# EAGLE design inktime (EAGLE 9.7.0)

## Sheet 1 of 2
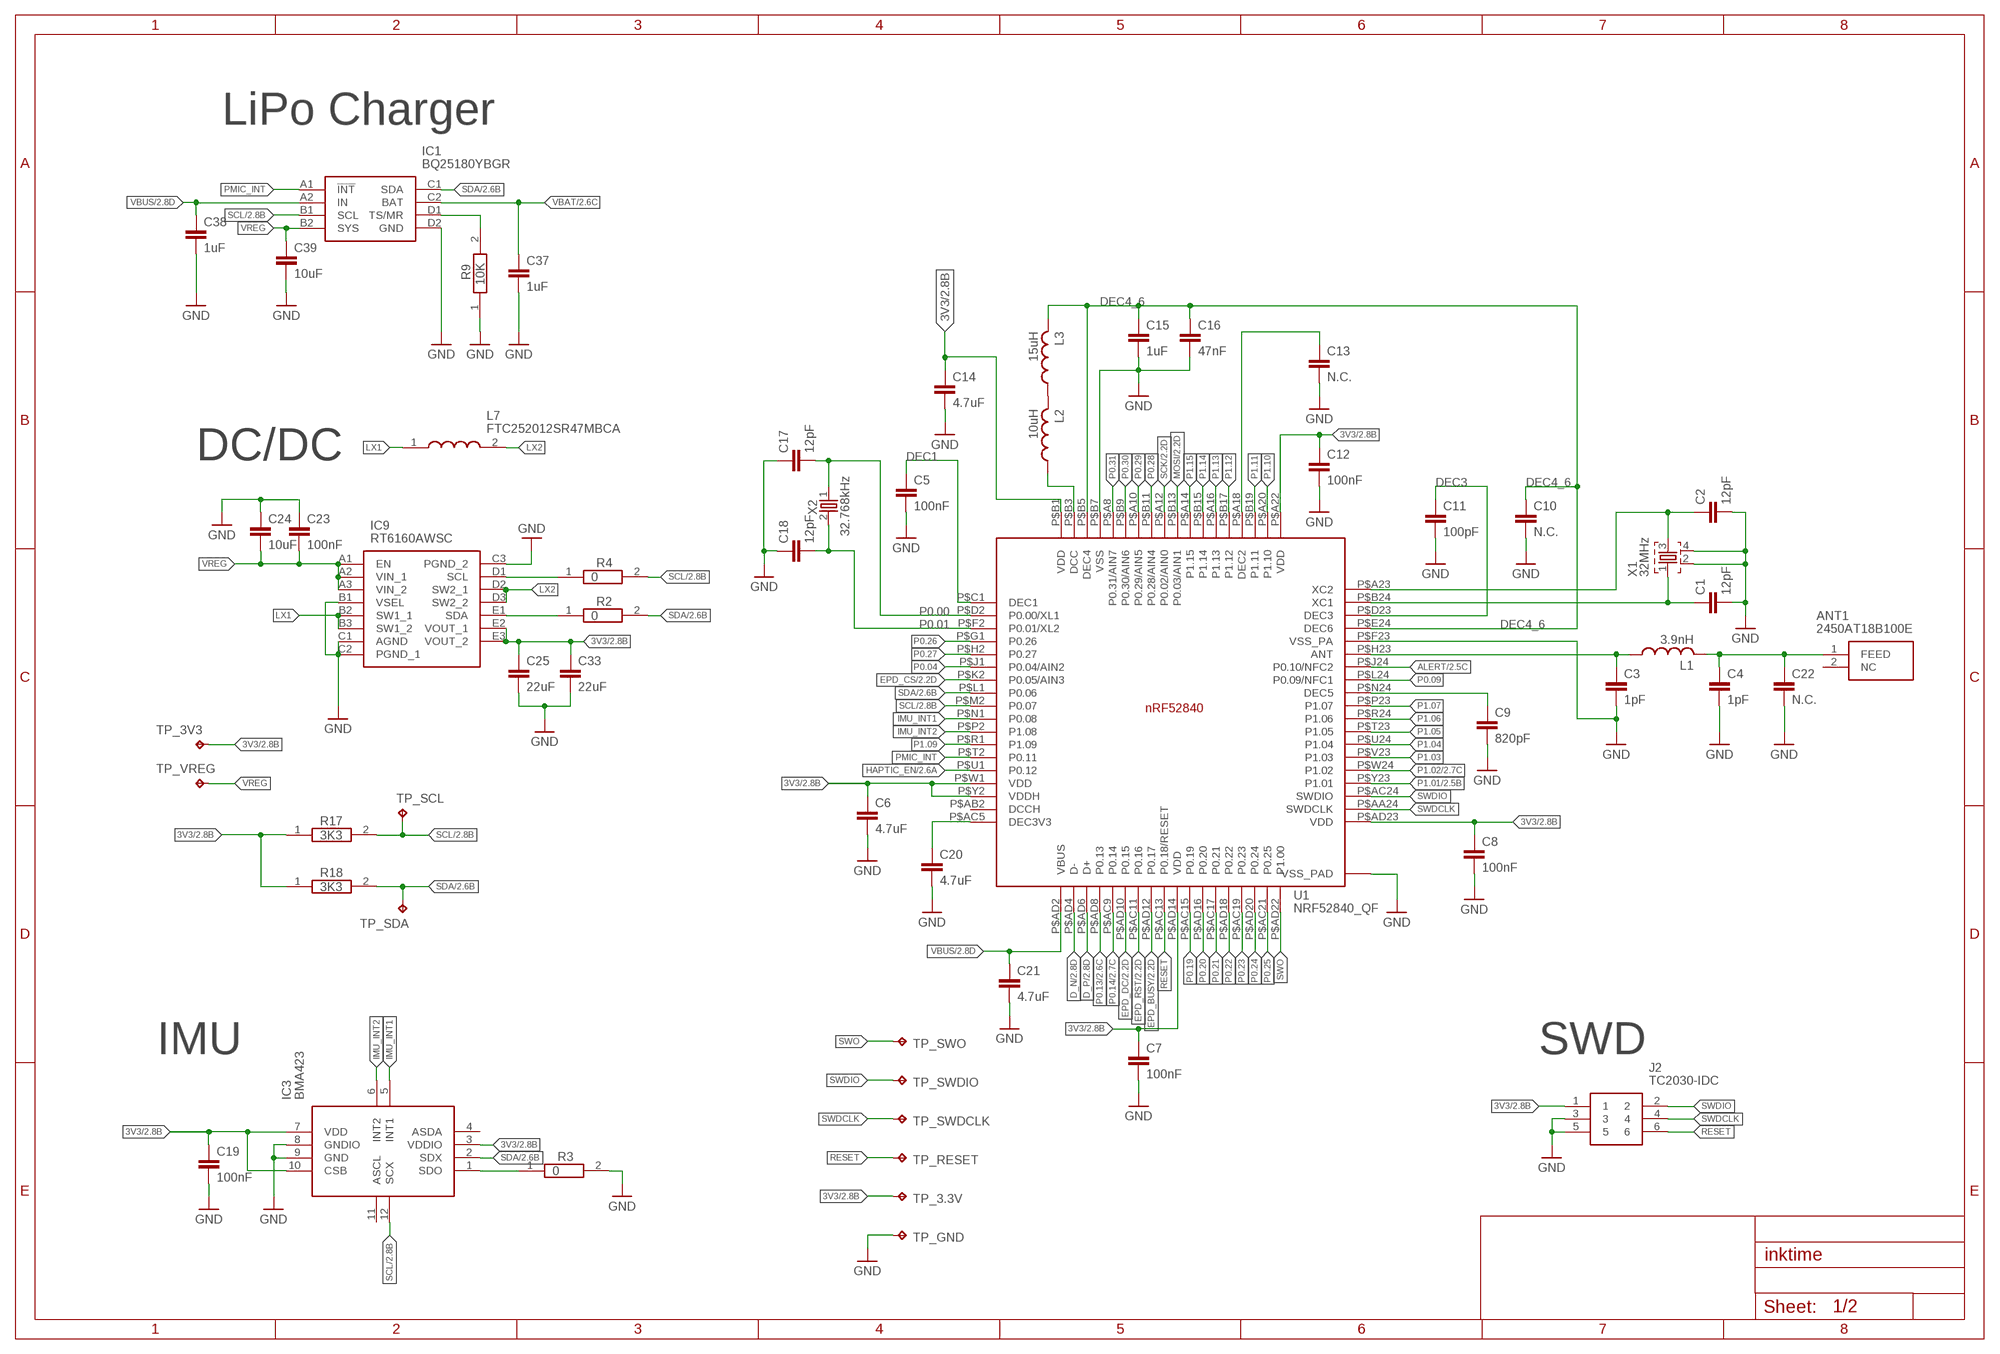
[diagram p0: schematic, sheet 1]

### Parts
ANT1  2450AT18B100E  2450AT18B100E_2450AT18B100E  [2450AT18B100E_ANTC3216X140N]
C1  12pF  NORDIC_NRF_3_CAPACITOR_0201_L  [NORDIC_NRF_3_RESC0201_L]
C2  12pF  NORDIC_NRF_3_CAPACITOR_0201_L  [NORDIC_NRF_3_RESC0201_L]
C3  1pF  NORDIC_NRF_3_CAPACITOR_0201_L  [NORDIC_NRF_3_RESC0201_L]
C4  1pF  NORDIC_NRF_3_CAPACITOR_0201_L  [NORDIC_NRF_3_RESC0201_L]
C5  100nF  NORDIC_NRF_3_CAPACITOR_0201_L  [NORDIC_NRF_3_RESC0201_L]
C6  4.7uF  NORDIC_NRF_3_CAPACITOR_0402_L  [NORDIC_NRF_3_RESC0402_L]
C7  100nF  NORDIC_NRF_3_CAPACITOR_0201_L  [NORDIC_NRF_3_RESC0201_L]
C8  100nF  NORDIC_NRF_3_CAPACITOR_0201_L  [NORDIC_NRF_3_RESC0201_L]
C9  820pF  NORDIC_NRF_3_CAPACITOR_0201_L  [NORDIC_NRF_3_RESC0201_L]
C10  N.C.  NORDIC_NRF_3_CAPACITOR_0201_L  [NORDIC_NRF_3_RESC0201_L]
C11  100pF  NORDIC_NRF_3_CAPACITOR_0201_L  [NORDIC_NRF_3_RESC0201_L]
C12  100nF  NORDIC_NRF_3_CAPACITOR_0201_L  [NORDIC_NRF_3_RESC0201_L]
C13  N.C.  NORDIC_NRF_3_CAPACITOR_0201_L  [NORDIC_NRF_3_RESC0201_L]
C14  4.7uF  NORDIC_NRF_3_CAPACITOR_0402_L  [NORDIC_NRF_3_RESC0402_L]
C15  1uF  NORDIC_NRF_3_CAPACITOR_0402_L  [NORDIC_NRF_3_RESC0402_L]
C16  47nF  NORDIC_NRF_3_CAPACITOR_0201_L  [NORDIC_NRF_3_RESC0201_L]
C17  12pF  NORDIC_NRF_3_CAPACITOR_0201_L  [NORDIC_NRF_3_RESC0201_L]
C18  12pF  NORDIC_NRF_3_CAPACITOR_0201_L  [NORDIC_NRF_3_RESC0201_L]
C19  100nF  NORDIC_NRF_3_CAPACITOR_0201_L  [NORDIC_NRF_3_RESC0201_L]
C20  4.7uF  NORDIC_NRF_3_CAPACITOR_0402_L  [NORDIC_NRF_3_RESC0402_L]
C21  4.7uF  NORDIC_NRF_3_CAPACITOR_0402_L  [NORDIC_NRF_3_RESC0402_L]
C22  N.C.  NORDIC_NRF_3_CAPACITOR_0201_L  [NORDIC_NRF_3_RESC0201_L]
C23  100nF  NORDIC_NRF_3_CAPACITOR_0201_L  [NORDIC_NRF_3_RESC0201_L]
C24  10uF  NORDIC_NRF_3_CAPACITOR_0402_L  [NORDIC_NRF_3_RESC0402_L]
C25  22uF  NORDIC_NRF_3_CAPACITOR_0402_L  [NORDIC_NRF_3_RESC0402_L]
C33  22uF  NORDIC_NRF_3_CAPACITOR_0402_L  [NORDIC_NRF_3_RESC0402_L]
C37  1uF  NORDIC_NRF_3_CAPACITOR_0402_L  [NORDIC_NRF_3_RESC0402_L]
C38  1uF  NORDIC_NRF_3_CAPACITOR_0402_L  [NORDIC_NRF_3_RESC0402_L]
C39  10uF  NORDIC_NRF_3_CAPACITOR_0402_L  [NORDIC_NRF_3_RESC0402_L]
IC1  BQ25180YBGR  BQ25180YBGR_BQ25180YBGR  [BQ25180YBGR_BGA8C40P2X4_100X155X50]
IC3  BMA423  BMA423_BMA423  [BMA423_BMA423]
IC9  RT6160AWSC  RT6160AWSC_RT6160AWSC  [RT6160AWSC_BGA15C40P3X5_140X230X60]
J2  TC2030-IDC  TC2030-IDC_TC2030-IDC  [TC2030-IDC_TC2030IDC]
L1  3.9nH  NORDIC_NRF_2_INDUCTOR_0402_L  [NORDIC_NRF_2_RESC0402_L]
L2  10uH  NORDIC_NRF_2_INDUCTOR_0402_L  [NORDIC_NRF_2_RESC0402_L]
L3  15uH  NORDIC_NRF_2_INDUCTOR_0402_L  [NORDIC_NRF_2_RESC0402_L]
L7  FTC252012SR47MBCA  MLP2016SR47MT0S1_FTC252012SR47MBCA  [MLP2016SR47MT0S1_INDC2016X100N]
R2  0  CPF0201D7K68C1_CPF0201D7K68C1  [CPF0201D7K68C1_0201]
R3  0  CPF0201D7K68C1_CPF0201D7K68C1  [CPF0201D7K68C1_0201]
R4  0  CPF0201D7K68C1_CPF0201D7K68C1  [CPF0201D7K68C1_0201]
R9  10K  CPF0201D7K68C1_CPF0201D7K68C1  [CPF0201D7K68C1_0201]
R17  3K3  CPF0201D7K68C1_CPF0201D7K68C1  [CPF0201D7K68C1_0201]
R18  3K3  CPF0201D7K68C1_CPF0201D7K68C1  [CPF0201D7K68C1_0201]
TP_3.3V  HECTOR_WATCH_1_TPTP20R  [HECTOR_WATCH_1_TP20R]
TP_3V3  HECTOR_WATCH_1_TPTP20R  [HECTOR_WATCH_1_TP20R]
TP_GND  HECTOR_WATCH_1_TPTP20R  [HECTOR_WATCH_1_TP20R]
TP_RESET  HECTOR_WATCH_1_TPTP20R  [HECTOR_WATCH_1_TP20R]
TP_SCL  HECTOR_WATCH_1_TPTP20R  [HECTOR_WATCH_1_TP20R]
TP_SDA  HECTOR_WATCH_1_TPTP20R  [HECTOR_WATCH_1_TP20R]
TP_SWDCLK  HECTOR_WATCH_1_TPTP20R  [HECTOR_WATCH_1_TP20R]
TP_SWDIO  HECTOR_WATCH_1_TPTP20R  [HECTOR_WATCH_1_TP20R]
TP_SWO  HECTOR_WATCH_1_TPTP20R  [HECTOR_WATCH_1_TP20R]
TP_VREG  HECTOR_WATCH_1_TPTP20R  [HECTOR_WATCH_1_TP20R]
U1  NRF52840_QF  NORDIC_NRF_4_NRF52840_QF  [NORDIC_NRF_4_AQFN50P700X700X85_HS-74N]
X1  32MHz  NORDIC_NRF_XTAL_32MHZ  [NORDIC_NRF_BT-XTAL_2016_N]
X2  32.768kHz  NORDIC_NRF_1_XTAL_32KHZ  [NORDIC_NRF_1_XTAL_3215_N]

### Nets
3V3: C6.1 C7.1 C8.1 C12.1 C14.1 C19.1 C25.1 C33.1 IC3.3(VDDIO) IC3.7(VDD) IC3.10(CSB) IC9.E2(VOUT_1) IC9.E3(VOUT_2) J2.1 R17.1 R18.1 TP_3.3V.TP TP_3V3.TP U1.P$A22(VDD) U1.P$AD14(VDD) U1.P$AD23(VDD) U1.P$B1(VDD) U1.P$W1(VDD) U1.P$Y2(VDDH) ; also sheet 2
ALERT: U1.P$J24(P0.10/NFC2) ; also sheet 2
D_N: U1.P$AD4(D-) ; also sheet 2
D_P: U1.P$AD6(D+) ; also sheet 2
DEC1: C5.1 U1.P$C1(DEC1)
DEC3: C11.1 U1.P$D23(DEC3)
DEC4_6: C10.1 C15.1 C16.1 L3.2 U1.P$B5(DEC4) U1.P$E24(DEC6)
EPD_BUSY: U1.P$AD12(P0.17) ; also sheet 2
EPD_CS: U1.P$K2(P0.05/AIN3) ; also sheet 2
EPD_DC: U1.P$AD10(P0.15) ; also sheet 2
EPD_RST: U1.P$AC11(P0.16) ; also sheet 2
GND: C1.2 C2.2 C3.2 C4.2 C5.2 C6.2 C7.2 C8.2 C9.2 C10.2 C11.2 C12.2 C13.2 C14.2 C15.2 C16.2 C17.1 C18.1 C19.2 C20.2 C21.2 C22.2 C23.1 C24.1 C25.2 C33.2 C37.2 C38.2 C39.2 IC1.D2(GND) IC3.8(GNDIO) IC3.9(GND) IC9.B1(VSEL) IC9.C1(AGND) IC9.C2(PGND_1) IC9.C3(PGND_2) J2.3 J2.5 R3.2 R9.1 TP_GND.TP U1.P$74(VSS_PAD) U1.P$75(VSS_PAD) U1.P$76(VSS_PAD) U1.P$77(VSS_PAD) U1.P$78(VSS_PAD) U1.P$79(VSS_PAD) U1.P$80(VSS_PAD) U1.P$81(VSS_PAD) U1.P$82(VSS_PAD) U1.P$83(VSS_PAD) U1.P$84(VSS_PAD) U1.P$85(VSS_PAD) U1.P$86(VSS_PAD) U1.P$87(VSS_PAD) U1.P$88(VSS_PAD) U1.P$89(VSS_PAD) U1.P$90(VSS_PAD) U1.P$B7(VSS) U1.P$F23(VSS_PA) X1.2 X1.4 ; also sheet 2
HAPTIC_EN: U1.P$U1(P0.12) ; also sheet 2
IMU_INT1: IC3.5(INT1) U1.P$N1(P0.08)
IMU_INT2: IC3.6(INT2) U1.P$P2(P1.08)
LX1: IC9.B2(SW1_1) IC9.B3(SW1_2) L7.1
LX2: IC9.D2(SW2_1) IC9.D3(SW2_2) L7.2
MOSI: U1.P$B13(P0.03/AIN1) ; also sheet 2
N$3: IC1.D1(TS/MR) R9.2
N$4: ANT1.1(FEED) C4.1 C22.1 L1.2
N$5: C2.1 U1.P$A23(XC2) X1.3
N$6: C1.1 U1.P$B24(XC1) X1.1
N$8: IC9.E1(SDA) R2.1
N$10: IC9.D1(SCL) R4.1
N$12: C13.1 U1.P$A18(DEC2)
N$14: IC3.1(SDO) R3.1
N$15: C20.1 U1.P$AC5(DEC3V3)
N$19: L2.1 U1.P$B3(DCC)
N$20: L2.2 L3.1
N$22: C9.1 U1.P$N24(DEC5)
N$25: C3.1 L1.1 U1.P$H23(ANT)
P0.00: C17.2 U1.P$D2(P0.00/XL1) X2.1
P0.01: C18.2 U1.P$F2(P0.01/XL2) X2.2
P0.04: U1.P$J1(P0.04/AIN2)
P0.09: U1.P$L24(P0.09/NFC1)
P0.13: U1.P$AD8(P0.13) ; also sheet 2
P0.14: U1.P$AC9(P0.14) ; also sheet 2
P0.19: U1.P$AC15(P0.19)
P0.20: U1.P$AD16(P0.20)
P0.21: U1.P$AC17(P0.21)
P0.22: U1.P$AD18(P0.22)
P0.23: U1.P$AC19(P0.23)
P0.24: U1.P$AD20(P0.24)
P0.25: U1.P$AC21(P0.25)
P0.26: U1.P$G1(P0.26)
P0.27: U1.P$H2(P0.27)
P0.28: U1.P$B11(P0.28/AIN4)
P0.29: U1.P$A10(P0.29/AIN5)
P0.30: U1.P$B9(P0.30/AIN6)
P0.31: U1.P$A8(P0.31/AIN7)
P1.01: U1.P$Y23(P1.01) ; also sheet 2
P1.02: U1.P$W24(P1.02) ; also sheet 2
P1.03: U1.P$V23(P1.03)
P1.04: U1.P$U24(P1.04)
P1.05: U1.P$T23(P1.05)
P1.06: U1.P$R24(P1.06)
P1.07: U1.P$P23(P1.07)
P1.09: U1.P$R1(P1.09)
P1.10: U1.P$A20(P1.10)
P1.11: U1.P$B19(P1.11)
P1.12: U1.P$B17(P1.12)
P1.13: U1.P$A16(P1.13)
P1.14: U1.P$B15(P1.14)
P1.15: U1.P$A14(P1.15)
PMIC_INT: IC1.A1(!INT) U1.P$T2(P0.11)
RESET: J2.6 TP_RESET.TP U1.P$AC13(P0.18/RESET)
SCK: U1.P$A12(P0.02/AIN0) ; also sheet 2
SCL: IC1.B1(SCL) IC3.12(SCX) R4.2 R17.2 TP_SCL.TP U1.P$M2(P0.07) ; also sheet 2
SDA: IC1.C1(SDA) IC3.2(SDX) R2.2 R18.2 TP_SDA.TP U1.P$L1(P0.06) ; also sheet 2
SWDCLK: J2.4 TP_SWDCLK.TP U1.P$AA24(SWDCLK)
SWDIO: J2.2 TP_SWDIO.TP U1.P$AC24(SWDIO)
SWO: TP_SWO.TP U1.P$AD22(P1.00)
VBAT: C37.1 IC1.C2(BAT) ; also sheet 2
VBUS: C21.1 C38.1 IC1.A2(IN) U1.P$AD2(VBUS) ; also sheet 2
VREG: C23.2 C24.2 C39.1 IC1.B2(SYS) IC9.A1(EN) IC9.A2(VIN_1) IC9.A3(VIN_2) TP_VREG.TP
Unconnected: ANT1.2(NC) IC3.4(ASDA) IC3.11(ASCL) U1.P$AB2(DCCH)

### Notes on the sheet
- LiPo Charger
- DC/DC
- IMU | SWD

## Sheet 2 of 2
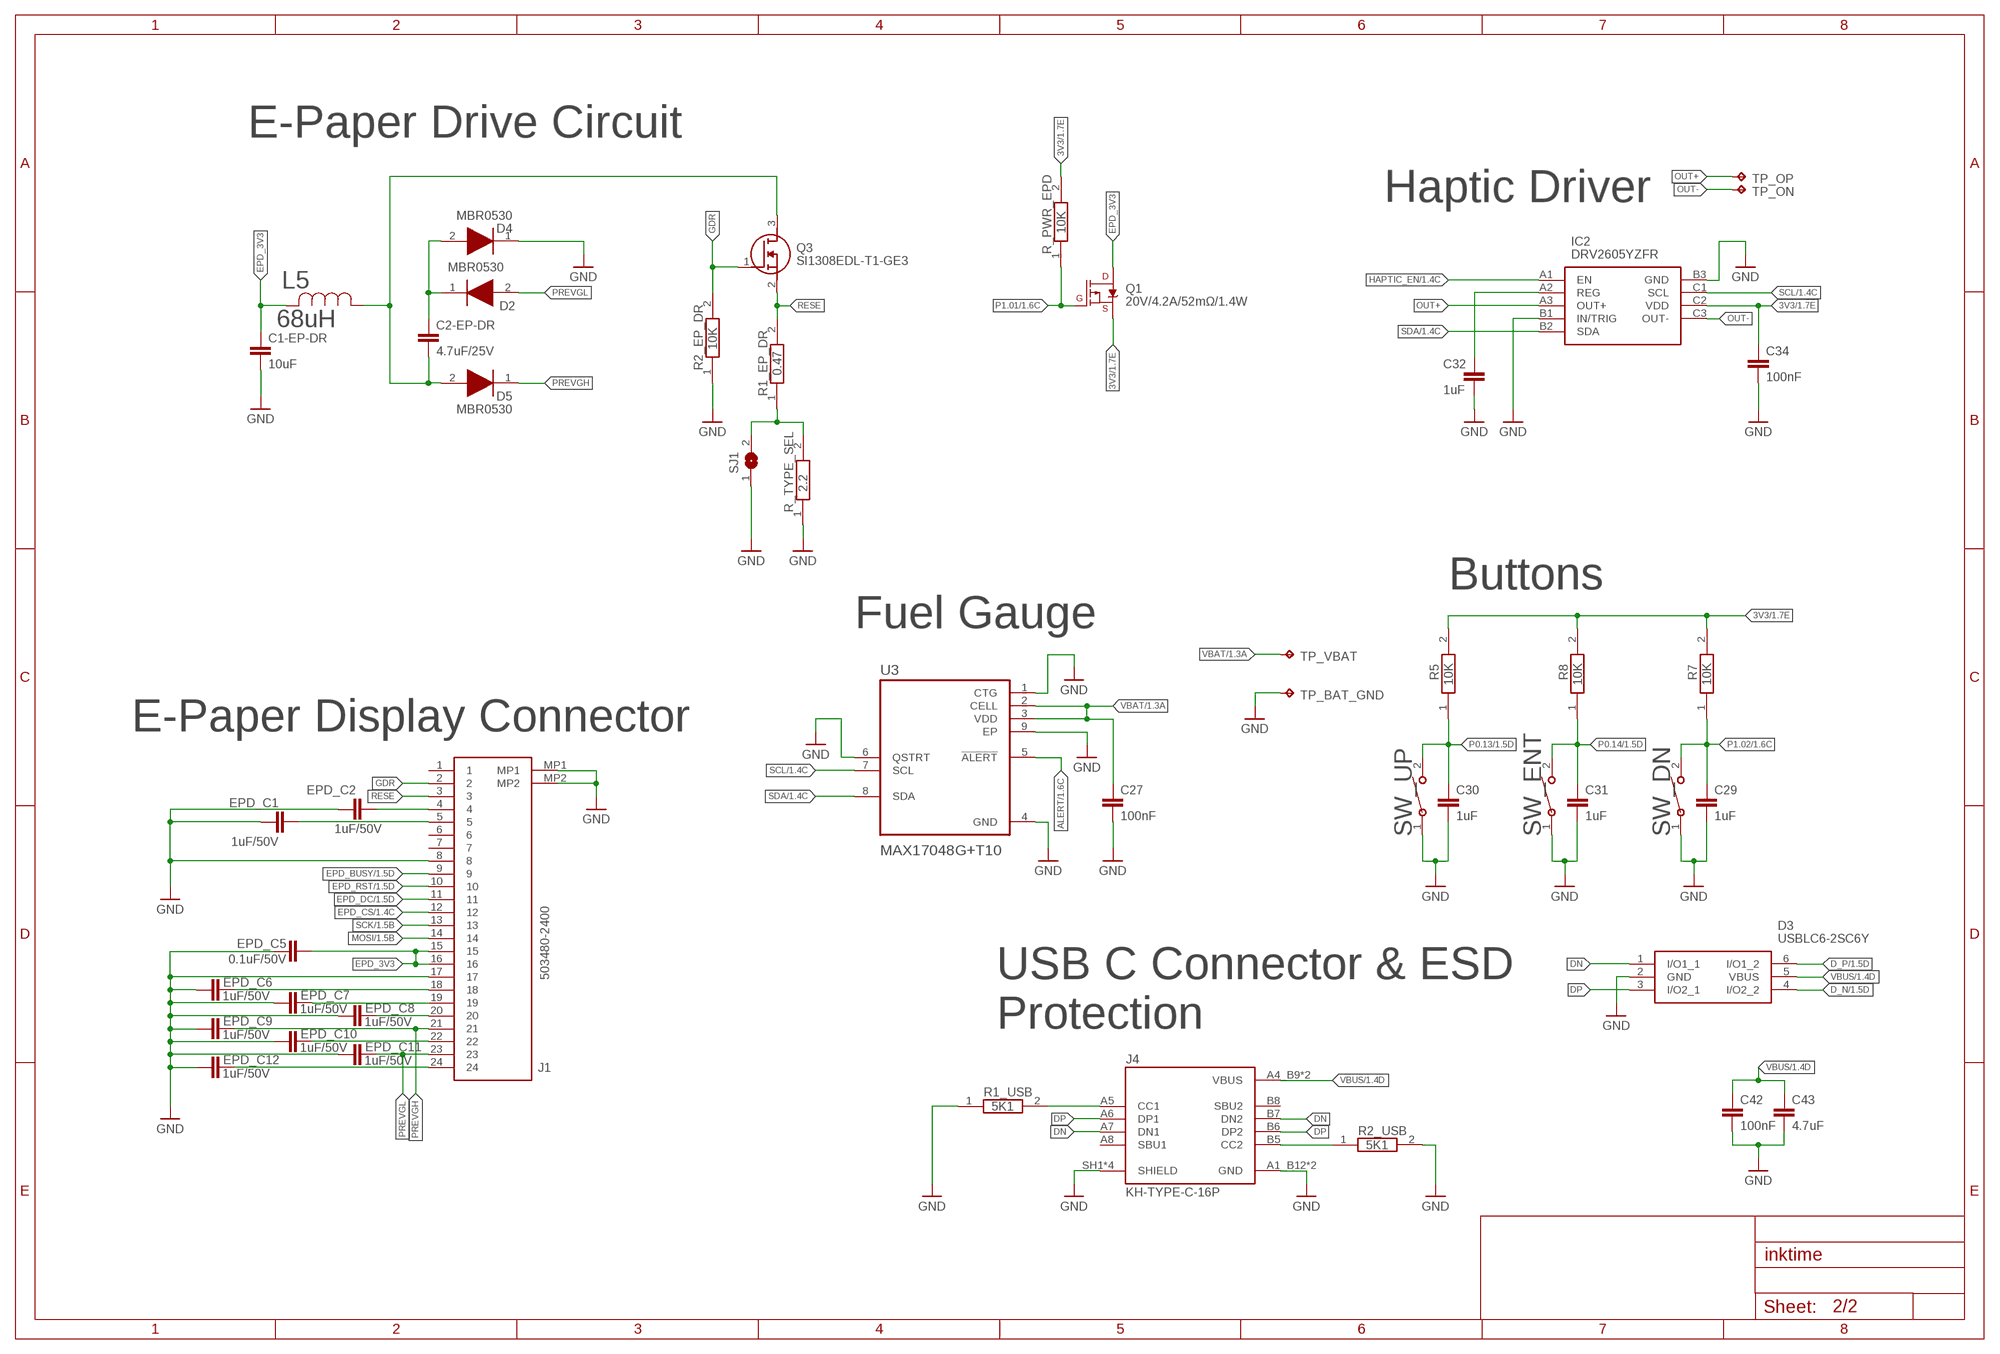
[diagram p1: schematic, sheet 2]

### Parts
C1-EP-DR  10uF  NORDIC_NRF_3_CAPACITOR_0402_L  [NORDIC_NRF_3_RESC0402_L]
C2-EP-DR  4.7uF/25V  NORDIC_NRF_3_CAPACITOR_0402_L  [NORDIC_NRF_3_RESC0402_L]
C27  100nF  NORDIC_NRF_3_CAPACITOR_0201_L  [NORDIC_NRF_3_RESC0201_L]
C29  1uF  NORDIC_NRF_3_CAPACITOR_0402_L  [NORDIC_NRF_3_RESC0402_L]
C30  1uF  NORDIC_NRF_3_CAPACITOR_0402_L  [NORDIC_NRF_3_RESC0402_L]
C31  1uF  NORDIC_NRF_3_CAPACITOR_0402_L  [NORDIC_NRF_3_RESC0402_L]
C32  1uF  NORDIC_NRF_3_CAPACITOR_0402_L  [NORDIC_NRF_3_RESC0402_L]
C34  100nF  NORDIC_NRF_3_CAPACITOR_0201_L  [NORDIC_NRF_3_RESC0201_L]
C42  100nF  NORDIC_NRF_3_CAPACITOR_0201_L  [NORDIC_NRF_3_RESC0201_L]
C43  4.7uF  NORDIC_NRF_3_CAPACITOR_0402_L  [NORDIC_NRF_3_RESC0402_L]
D2  MBR0530  ESP32_C6_LIBRARY_5_MBR0530SOD  [ESP32_C6_LIBRARY_5_SOD3716X135N]
D3  USBLC6-2SC6Y  ESP32_C6_LIBRARY_3_USBLC6-2SC6Y  [ESP32_C6_LIBRARY_3_SOT95P280X145-6N]
D4  MBR0530  ESP32_C6_LIBRARY_5_MBR0530SOD  [ESP32_C6_LIBRARY_5_SOD3716X135N]
D5  MBR0530  ESP32_C6_LIBRARY_5_MBR0530SOD  [ESP32_C6_LIBRARY_5_SOD3716X135N]
EPD_C1  1uF/50V  NORDIC_NRF_3_CAPACITOR_0402_L  [NORDIC_NRF_3_RESC0402_L]
EPD_C2  1uF/50V  NORDIC_NRF_3_CAPACITOR_0402_L  [NORDIC_NRF_3_RESC0402_L]
EPD_C5  0.1uF/50V  NORDIC_NRF_3_CAPACITOR_0201_L  [NORDIC_NRF_3_RESC0201_L]
EPD_C6  1uF/50V  NORDIC_NRF_3_CAPACITOR_0402_L  [NORDIC_NRF_3_RESC0402_L]
EPD_C7  1uF/50V  NORDIC_NRF_3_CAPACITOR_0402_L  [NORDIC_NRF_3_RESC0402_L]
EPD_C8  1uF/50V  NORDIC_NRF_3_CAPACITOR_0402_L  [NORDIC_NRF_3_RESC0402_L]
EPD_C9  1uF/50V  NORDIC_NRF_3_CAPACITOR_0402_L  [NORDIC_NRF_3_RESC0402_L]
EPD_C10  1uF/50V  NORDIC_NRF_3_CAPACITOR_0402_L  [NORDIC_NRF_3_RESC0402_L]
EPD_C11  1uF/50V  NORDIC_NRF_3_CAPACITOR_0402_L  [NORDIC_NRF_3_RESC0402_L]
EPD_C12  1uF/50V  NORDIC_NRF_3_CAPACITOR_0402_L  [NORDIC_NRF_3_RESC0402_L]
IC2  DRV2605YZFR  DRV2605YZFR_DRV2605YZFR  [DRV2605YZFR_BGA9C50P3X3_144X144X62]
J1  503480-2400  503480-2400_503480-2400  [503480-2400_5034802400]
J4  KH-TYPE-C-16P  KH-TYPE-C-16P_KH-TYPE-C-16P  [KH-TYPE-C-16P_KINGHELM_KH-TYPE-C-16P]
L5  68uH  ESP32_C6_LIBRARY_2_744043680IND_4828-WE-TPC_WRE  [ESP32_C6_LIBRARY_2_IND_4828-WE-TPC_WRE]
Q1  20V/4.2A/52mΩ/1.4W  ESP32_C6_LIBRARY_4_ESP32_WROVER_SPARKFUN-DISCRETESEMI_MOSFET_PCH-DMG2305UX-7  [ESP32_C6_LIBRARY_4_ESP32_C6_LIBRARY_4_ESP32_C6_LIBRARY_4_ESP32_C6_LIBRARY_4_ESP32_WROVER_SPARKFUN-DISCRETESEMI_SOT23-3]
Q3  SI1308EDL-T1-GE3  ESP32_C6_LIBRARY_6_SI1308EDL-T1-GE3  [ESP32_C6_LIBRARY_6_SOT65P210X110-3N]
R1_EP_DR  0.47  CPF0201D7K68C1_CPF0201D7K68C1  [CPF0201D7K68C1_0201]
R1_USB  5K1  CPF0201D7K68C1_CPF0201D7K68C1  [CPF0201D7K68C1_0201]
R2_EP_DR  10K  CPF0201D7K68C1_CPF0201D7K68C1  [CPF0201D7K68C1_0201]
R2_USB  5K1  CPF0201D7K68C1_CPF0201D7K68C1  [CPF0201D7K68C1_0201]
R5  10K  CPF0201D7K68C1_CPF0201D7K68C1  [CPF0201D7K68C1_0201]
R7  10K  CPF0201D7K68C1_CPF0201D7K68C1  [CPF0201D7K68C1_0201]
R8  10K  CPF0201D7K68C1_CPF0201D7K68C1  [CPF0201D7K68C1_0201]
R_PWR_EPD  10K  CPF0201D7K68C1_CPF0201D7K68C1  [CPF0201D7K68C1_0201]
R_TYPE_SEL  2.2  CPF0201D7K68C1_CPF0201D7K68C1  [CPF0201D7K68C1_0201]
SJ1  ESP32_C6_LIBRARY_7_JUMPER_SJ  [ESP32_C6_LIBRARY_7_JUMPER_SJ]
SW_DN  2025-10-22_07-23-44_LIBRARY_EVP-AKE31ASW_EVP-AKE31A_PAN  [2025-10-22_07-23-44_LIBRARY_SW_EVP-AKE31A_PAN]
SW_ENT  2025-10-22_07-23-44_LIBRARY_EVP-AKE31ASW_EVP-AKE31A_PAN  [2025-10-22_07-23-44_LIBRARY_SW_EVP-AKE31A_PAN]
SW_UP  2025-10-22_07-23-44_LIBRARY_EVP-AKE31ASW_EVP-AKE31A_PAN  [2025-10-22_07-23-44_LIBRARY_SW_EVP-AKE31A_PAN]
TP_BAT_GND  HECTOR_WATCH_1_TPTP20R  [HECTOR_WATCH_1_TP20R]
TP_ON  HECTOR_WATCH_1_TPTP20R  [HECTOR_WATCH_1_TP20R]
TP_OP  HECTOR_WATCH_1_TPTP20R  [HECTOR_WATCH_1_TP20R]
TP_VBAT  HECTOR_WATCH_1_TPTP20R  [HECTOR_WATCH_1_TP20R]
U3  MAX17048G+T10  ESP32_C6_LIBRARY_MAX17048G+T10  [ESP32_C6_LIBRARY_SON50P200X200X80-9N]

### Nets
3V3: C34.1 IC2.C2(VDD) Q1.2(S) R5.2 R7.2 R8.2 R_PWR_EPD.2 ; also sheet 1
ALERT: U3.5(!ALERT) ; also sheet 1
D_N: D3.4(I/O2_2) ; also sheet 1
D_P: D3.6(I/O1_2) ; also sheet 1
DN: D3.1(I/O1_1) J4.A7(DN1) J4.B7(DN2)
DP: D3.3(I/O2_1) J4.A6(DP1) J4.B6(DP2)
EPD_3V3: C1-EP-DR.1 EPD_C5.2 J1.15 J1.16 L5.2 Q1.3(D)
EPD_BUSY: J1.9 ; also sheet 1
EPD_CS: J1.12 ; also sheet 1
EPD_DC: J1.11 ; also sheet 1
EPD_RST: J1.10 ; also sheet 1
GDR: J1.2 Q3.1(G) R2_EP_DR.2
GND: C1-EP-DR.2 C27.2 C29.2 C30.2 C31.2 C32.2 C34.2 C42.2 C43.2 D3.2(GND) D4.1(K) EPD_C1.1 EPD_C2.1 EPD_C5.1 EPD_C6.1 EPD_C7.1 EPD_C8.1 EPD_C9.1 EPD_C10.1 EPD_C11.1 EPD_C12.1 IC2.B1(IN/TRIG) IC2.B3(GND) J1.8 J1.17 J1.MP1 J1.MP2 J4.A1_B12(GND) J4.A12_B1(GND) J4.SH1(SHIELD) J4.SH2(SHIELD) J4.SH3(SHIELD) J4.SH4(SHIELD) R1_USB.1 R2_EP_DR.1 R2_USB.2 R_TYPE_SEL.1 SJ1.1 SW_DN.1 SW_ENT.1 SW_UP.1 TP_BAT_GND.TP U3.1(CTG) U3.4(GND) U3.6(QSTRT) U3.9(EP) ; also sheet 1
HAPTIC_EN: IC2.A1(EN) ; also sheet 1
MOSI: J1.14 ; also sheet 1
N$1: EPD_C2.2 J1.4
N$2: C2-EP-DR.1 D2.1(K) D4.2(A)
N$7: C2-EP-DR.2 D5.2(A) L5.1 Q3.3(D)
N$9: EPD_C1.2 J1.5
N$11: R1_EP_DR.1 R_TYPE_SEL.2 SJ1.2
N$13: EPD_C6.2 J1.18
N$16: EPD_C7.2 J1.19
N$17: EPD_C8.2 J1.20
N$21: EPD_C10.2 J1.22
N$23: C32.1 IC2.A2(REG)
N$26: EPD_C12.2 J1.24
N$28: J4.B5(CC2) R2_USB.1
N$33: J4.A5(CC1) R1_USB.2
OUT+: IC2.A3(OUT+) TP_OP.TP
OUT-: IC2.C3(OUT-) TP_ON.TP
P0.13: C30.1 R5.1 SW_UP.2 ; also sheet 1
P0.14: C31.1 R8.1 SW_ENT.2 ; also sheet 1
P1.01: Q1.1(G) R_PWR_EPD.1 ; also sheet 1
P1.02: C29.1 R7.1 SW_DN.2 ; also sheet 1
PREVGH: D5.1(K) EPD_C9.2 J1.21
PREVGL: D2.2(A) EPD_C11.2 J1.23
RESE: J1.3 Q3.2(S) R1_EP_DR.2
SCK: J1.13 ; also sheet 1
SCL: IC2.C1(SCL) U3.7(SCL) ; also sheet 1
SDA: IC2.B2(SDA) U3.8(SDA) ; also sheet 1
VBAT: C27.1 TP_VBAT.TP U3.2(CELL) U3.3(VDD) ; also sheet 1
VBUS: C42.1 C43.1 D3.5(VBUS) J4.A4_B9(VBUS) J4.A9_B4(VBUS) ; also sheet 1
Unconnected: J1.1 J1.6 J1.7 J4.A8(SBU1) J4.B8(SBU2)

### Notes on the sheet
- E-Paper Drive Circuit
- Haptic Driver
- Buttons
- Fuel Gauge
- E-Paper Display Connector
- USB C Connector & ESD
  Protection

## Library data of the parts
ANT1 = InkTime_v5:2450AT18B100E_2450AT18B100E: Antennas 2.45GHz ANTENNA Source: Datasheet <https://www.johansontechnology.com/datasheets/2450AT18B100/2450AT18B100.pdf>; ARROW_PART_NUMBER: 2450AT18B100E; ARROW_PRICE-STOCK: https://www.arrow.com/en/products/2450at18b100e/johanson-dielectrics?utm_currency=USD&region=nac; DESCRIPTION: Antennas 2.45GHz ANTENNA; HEIGHT: 1.4mm; MANUFACTURER_NAME: JOHANSON TECHNOLOGY; MANUFACTURER_PART_NUMBER: 2450AT18B100E; MOUSER_PART_NUMBER: 609-2450AT18B100E; MOUSER_PRICE-STOCK: https://www.mouser.co.uk/ProductDetail/Johanson-Technology/2450AT18B100E?qs=yCnrNFeXz%252Bh5MFsFIXGZGA%3D%3D
C1 C1-EP-DR C2 C2-EP-DR C3-C25 C27 C29-C34 C37-C39 C42 C43 EPD_C1 EPD_C2 EPD_C5-EPD_C12 = InkTime_v5:NORDIC_NRF_3_CAPACITOR: Generic chip capacitor
D2 D4 D5 = InkTime_v5:ESP32_C6_LIBRARY_5_MBR0530: ON SEMICONDUCTOR - MBR0530 - DIODE, SCHOTTKY, 0.5A, 30V, SOD-123 Source: Datasheet <http://www.onsemi.com/pub/Collateral/MBR0530T1-D.PDF> Check availability <https://pricing.snapeda.com/parts/MBR0530/ON%20Semiconductor/view-part?ref=eda>
D3 = InkTime_v5:ESP32_C6_LIBRARY_3_USBLC6-2SC6Y: Low Cap. ESD Protection Auto SOT-23-6 STMicroelectronics USBLC6-2SC6Y, Dual Uni-Directional TVS Diode Array, 6-Pin SOT-23 Source: Datasheet <https://componentsearchengine.com/Datasheets/1/USBLC6-2SC6Y.pdf> Check availability <https://pricing.snapeda.com/parts/USBLC6-2SC6Y/STMicroelectronics/view-part?ref=eda>; AVAILABILITY: In Stock; CHECK_PRICES: https://www.snapeda.com/parts/USBLC6-2SC6Y/STMicroelectronics/view-part/?ref=eda; DESCRIPTION: 17V Clamp 5A (8/20µs) Ipp Tvs Diode Surface Mount SOT-23-6; MF: STMicroelectronics; MP: USBLC6-2SC6Y; PACKAGE: SOT-23-6 STMicroelectronics; PRICE: None; SNAPEDA_LINK: https://www.snapeda.com/parts/USBLC6-2SC6Y/STMicroelectronics/view-part/?ref=snap
IC1 = InkTime_v5:BQ25180YBGR_BQ25180YBGR: Charger IC Lithium Ion/Polymer, Lithium Iron Phosphate 8-DSBGA (1.6x1.1) Source: Datasheet <https://www.ti.com/lit/ds/symlink/bq25180.pdf?ts=1650264094470&ref_url=https%3A%2F%2Fwww.ti.com%2Fproduct%2FBQ25180>; ARROW_PART_NUMBER: BQ25180YBGR; ARROW_PRICE-STOCK: https://www.arrow.com/en/products/bq25180ybgr/texas-instruments?utm_currency=USD&region=nac; DESCRIPTION: Charger IC Lithium Ion/Polymer, Lithium Iron Phosphate 8-DSBGA (1.6x1.1); HEIGHT: 0.5mm; MANUFACTURER_NAME: Texas Instruments; MANUFACTURER_PART_NUMBER: BQ25180YBGR; MOUSER_PART_NUMBER: 595-BQ25180YBGR; MOUSER_PRICE-STOCK: https://www.mouser.co.uk/ProductDetail/Texas-Instruments/BQ25180YBGR?qs=doiCPypUmgEWjAK%252BJAX6Tw%3D%3D
IC2 = InkTime_v5:DRV2605YZFR_DRV2605YZFR: Haptic Driver for ERM/LRA with Built-In Library and Smart Loop Architecture Source: Datasheet <http://www.ti.com/lit/gpn/drv2605>; ARROW_PART_NUMBER: DRV2605YZFR; ARROW_PRICE-STOCK: https://www.arrow.com/en/products/drv2605yzfr/texas-instruments?region=nac; DESCRIPTION: Haptic Driver for ERM/LRA with Built-In Library and Smart Loop Architecture; HEIGHT: 0.625mm; MANUFACTURER_NAME: Texas Instruments; MANUFACTURER_PART_NUMBER: DRV2605YZFR
IC3 = InkTime_v5:BMA423_BMA423: Accelerometers Triaxial low-g 12bit Acceleration Sensor Source: Datasheet <https://www.mouser.com/datasheet/2/783/BST-BMA423-DS000-1509600.pdf>; ARROW_PART_NUMBER: BMA423; ARROW_PRICE-STOCK: https://www.arrow.com/en/products/bma423/bosch; DESCRIPTION: Accelerometers Triaxial low-g 12bit Acceleration Sensor; HEIGHT: 1mm; MANUFACTURER_NAME: BOSCH; MANUFACTURER_PART_NUMBER: BMA423; MOUSER_PART_NUMBER: 262-BMA423; MOUSER_PRICE-STOCK: https://www.mouser.co.uk/ProductDetail/Bosch-Sensortec/BMA423?qs=HXFqYaX1Q2xC%252BSgeGoX3mg%3D%3D
IC9 = InkTime_v5:RT6160AWSC_RT6160AWSC: Buck-Boost Regulator Positive Output Step-Up/Step-Down I2C DC-DC Controller IC 15-WL-CSP (BSC) (1.4x2.3) Source: Datasheet <https://www.richtek.com/SaveDownload.aspx?specid=RT6160A>; DESCRIPTION: Buck-Boost Regulator Positive Output Step-Up/Step-Down I2C DC-DC Controller IC 15-WL-CSP (BSC) (1.4x2.3); HEIGHT: 0.6mm; MANUFACTURER_NAME: RICHTEK; MANUFACTURER_PART_NUMBER: RT6160AWSC; MOUSER_PART_NUMBER: 835-RT6160AWSC; MOUSER_PRICE-STOCK: https://www.mouser.co.uk/ProductDetail/Richtek/RT6160AWSC?qs=amGC7iS6iy%2FLd9PSoixZXQ%3D%3D
J1 = InkTime_v5:503480-2400_503480-2400: FFC & FPC Connectors 0.5mm FPC RA SMT Dual Contact 24Ckt Source: Datasheet <https://componentsearchengine.com/Datasheets/1/503480-2400.pdf>; DESCRIPTION: FFC & FPC Connectors 0.5mm FPC RA SMT Dual Contact 24Ckt; HEIGHT: 1.87mm; MANUFACTURER_NAME: Molex; MANUFACTURER_PART_NUMBER: 503480-2400; MOUSER_PART_NUMBER: 538-503480-2400; MOUSER_PRICE-STOCK: https://www.mouser.co.uk/ProductDetail/Molex/503480-2400?qs=OAhjpuo3Vu7efIoxFh9AOw%3D%3D
J2 = InkTime_v5:TC2030-IDC_TC2030-IDC: CABLE ADAPTER 6 POS Source: Datasheet <https://datasheet.datasheetarchive.com/originals/distributors/Datasheets_SAMA/62bc384e093448baaaa63dbd0b9d8707.pdf>; DESCRIPTION: CABLE ADAPTER 6 POS; HEIGHT: 19mm; MANUFACTURER_NAME: Tag Connect; MANUFACTURER_PART_NUMBER: TC2030-IDC
J4 = InkTime_v5:KH-TYPE-C-16P_KH-TYPE-C-16P: Check availability <https://pricing.snapeda.com/parts/KH-TYPE-C-16P/kinghelm/view-part?ref=eda>; AVAILABILITY: Not in stock; CHECK_PRICES: https://www.snapeda.com/parts/KH-TYPE-C-16P/Kinghelm/view-part/?ref=eda; MF: kinghelm; MP: KH-TYPE-C-16P; PACKAGE: None; PRICE: None; SNAPEDA_LINK: https://www.snapeda.com/parts/KH-TYPE-C-16P/Kinghelm/view-part/?ref=snap
L1-L3 = InkTime_v5:NORDIC_NRF_2_INDUCTOR: Generic chip inductor
L5 = InkTime_v5:ESP32_C6_LIBRARY_2_744043680; COPYRIGHT: Copyright (C) 2024 Ultra Librarian. All rights reserved.; MANUFACTURER_PART_NUMBER: 744043680; MFR_NAME: Wurth Electronics
L7 = InkTime_v5:MLP2016SR47MT0S1_FTC252012SR47MBCA: SMD / SMT Inductors (Coils), L=0.47?H, L x W x T : Source: Datasheet <https://product.tdk.com/system/files/dam/doc/product/inductor/inductor/smd/catalog/inductor_commercial_power_mlp2016_en.pdf>; DESCRIPTION: SMD / SMT Inductors (Coils), L=0.47?H, L x W x T :; HEIGHT: 1mm; JLCPCB: https://jlcpcb.com/partdetail/6763488-FTC252012SR47MBCA/C5832368; MANUFACTURER_NAME: TDK; MANUFACTURER_PART_NUMBER: FTC252012SR47MBCA
Q1 = InkTime_v5:ESP32_C6_LIBRARY_4_ESP32_WROVER_SPARKFUN-DISCRETESEMI_MOSFET_PCH: P-channel MOSFETs Voltage controlled devices that allow control of high current outputs. SparkFun Products: SparkFun ESP32 Thing <https://www.sparkfun.com/products/13907> SparkFun ESP8266 Thing <https://www.sparkfun.com/products/13231> SparkFun Pi Servo HAT V2 <https://www.sparkfun.com/products/15316> DMG2305UX-7 (20V/4.2A/SOT23-3); PROD_ID: TRAN-14388
Q3 = InkTime_v5:ESP32_C6_LIBRARY_6_SI1308EDL-T1-GE3: MOSFET N-Ch 30V 1.5A TrenchFET SC70 Vishay Si1308EDL-T1-GE3 N-channel MOSFET Transistor, 1.5 A, 30 V, 3-Pin SC-70 Source: Datasheet <https://componentsearchengine.com/Datasheets/1/SI1308EDL-T1-GE3.pdf> Check availability <https://pricing.snapeda.com/parts/SI1308EDL-T1-GE3/Vishay%20Siliconix/view-part?ref=eda>; AVAILABILITY: In Stock; CHECK_PRICES: https://www.snapeda.com/parts/SI1308EDL-T1-GE3/Vishay+Siliconix/view-part/?ref=eda; DESCRIPTION: Si1308EDL-T1-GE3 N-channel MOSFET Transistor, 1.5 A, 30 V, 3-Pin SC-70 | Siliconix / Vishay SI1308EDL-T1-GE3; MF: Vishay Siliconix; MP: SI1308EDL-T1-GE3; PACKAGE: SOT-323 Vishay Semiconductor; PRICE: None; PURCHASE-URL: https://www.snapeda.com/api/url_track_click_mouser/?unipart_id=274603&manufacturer=Vishay Siliconix&part_name=SI1308EDL-T1-GE3&search_term=None; SNAPEDA_LINK: https://www.snapeda.com/parts/SI1308EDL-T1-GE3/Vishay+Siliconix/view-part/?ref=snap
R1_EP_DR R1_USB R2 R2_EP_DR R2_USB R3-R5 R7-R9 R17 R18 R_PWR_EPD R_TYPE_SEL = InkTime_v5:CPF0201D7K68C1_CPF0201D7K68C1: 7.68k 0201 Thin Film Surface Mount Fixed Resistor +/-0.5% 0.031W CPF0201D7K68C1 Source: Datasheet <http://www.te.com/commerce/DocumentDelivery/DDEController?Action=showdoc&DocId=Data Sheet1773200-1ApdfEnglishENG_DS_1773200-1_A.pdf4-2176215-6>
SJ1 = InkTime_v5:ESP32_C6_LIBRARY_7_JUMPER_SJ: SMD solder JUMPER
SW_DN SW_ENT SW_UP = InkTime_v5:2025-10-22_07-23-44_LIBRARY_EVP-AKE31A; COPYRIGHT: Copyright (C) 2025 Ultra Librarian. All rights reserved.; DIGI-KEY_PART_NUMBER_1: P123437TR-ND; DIGI-KEY_PART_NUMBER_2: P123437CT-ND; DIGI-KEY_PART_NUMBER_3: P123437DKR-ND; MANUFACTURER_NAME: Panasonic; MANUFACTURER_PART_NUMBER: EVP-AKE31A
TP_3.3V TP_3V3 TP_BAT_GND TP_GND TP_ON TP_OP TP_RESET TP_SCL TP_SDA TP_SWDCLK TP_SWDIO TP_SWO TP_VBAT TP_VREG = InkTime_v5:HECTOR_WATCH_1_TP: Test pad
U1 = InkTime_v5:NORDIC_NRF_4_NRF52840_QF: nRF52840 Features Advanced Single chip 2.4 GHz multi-protocol SoC 32-bit ARM Cortex-M4F Processor 1.7v to 5.5v operation 1MB flash + 256kB RAM Bluetooth 5 support for long range and high throughput 802.15.4 radio support On-chip NFC PPI –Programmable Peripheral Interconnect Automated power management system with automatic power management of each peripheral Configurable I/O mapping for analog and digital I/O 48 x GPIO 1 x QSPI 4 x Master/Slave SPI 2 x Two-wire interface (I²C) I²S interface 2 x UART 4 x PWM USB 2.0 controller ARM TrustZone CryptoCell-310 Cryptographic and security module AES 128-bit ECB/CCM/AAR hardware accelerator Digital microphone interface (PDM) Quadrature decoder 12-bit ADC Low power comparator On-chip 50Ω balun On-air compatible with nRF52, nRF51 and nRF24 Series Applications Advanced high performance wearables Wearables for secure payments Virtual Reality/Augmented Reality systems Smart Home sensor networks Smart city sensor networks High performance HID controllers Internet of Things (IoT) sensor networks Smart door locks Smart lighting networks Connected white goods
U3 = InkTime_v5:ESP32_C6_LIBRARY_MAX17048G+T10: Check availability <https://pricing.snapeda.com/parts/MAX17048G%2BT10/Analog%20Devices/view-part?ref=eda>; AVAILABILITY: In Stock; CHECK_PRICES: https://www.snapeda.com/parts/MAX17048G+T10/Analog+Devices/view-part/?ref=eda; DESCRIPTION: 3µA 1-Cell/2-Cell Fuel Gauge with ModelGauge; MF: Analog Devices; MP: MAX17048G+T10; PACKAGE: TDFN-8 Maxim; PRICE: None; PURCHASE-URL: https://www.snapeda.com/api/url_track_click_mouser/?unipart_id=329239&manufacturer=Analog Devices&part_name=MAX17048G+T10&search_term=None; SNAPEDA_LINK: https://www.snapeda.com/parts/MAX17048G+T10/Analog+Devices/view-part/?ref=snap
X1 = InkTime_v5:NORDIC_NRF_XTAL_32MHZ
X2 = InkTime_v5:NORDIC_NRF_1_XTAL_32KHZ

## Board
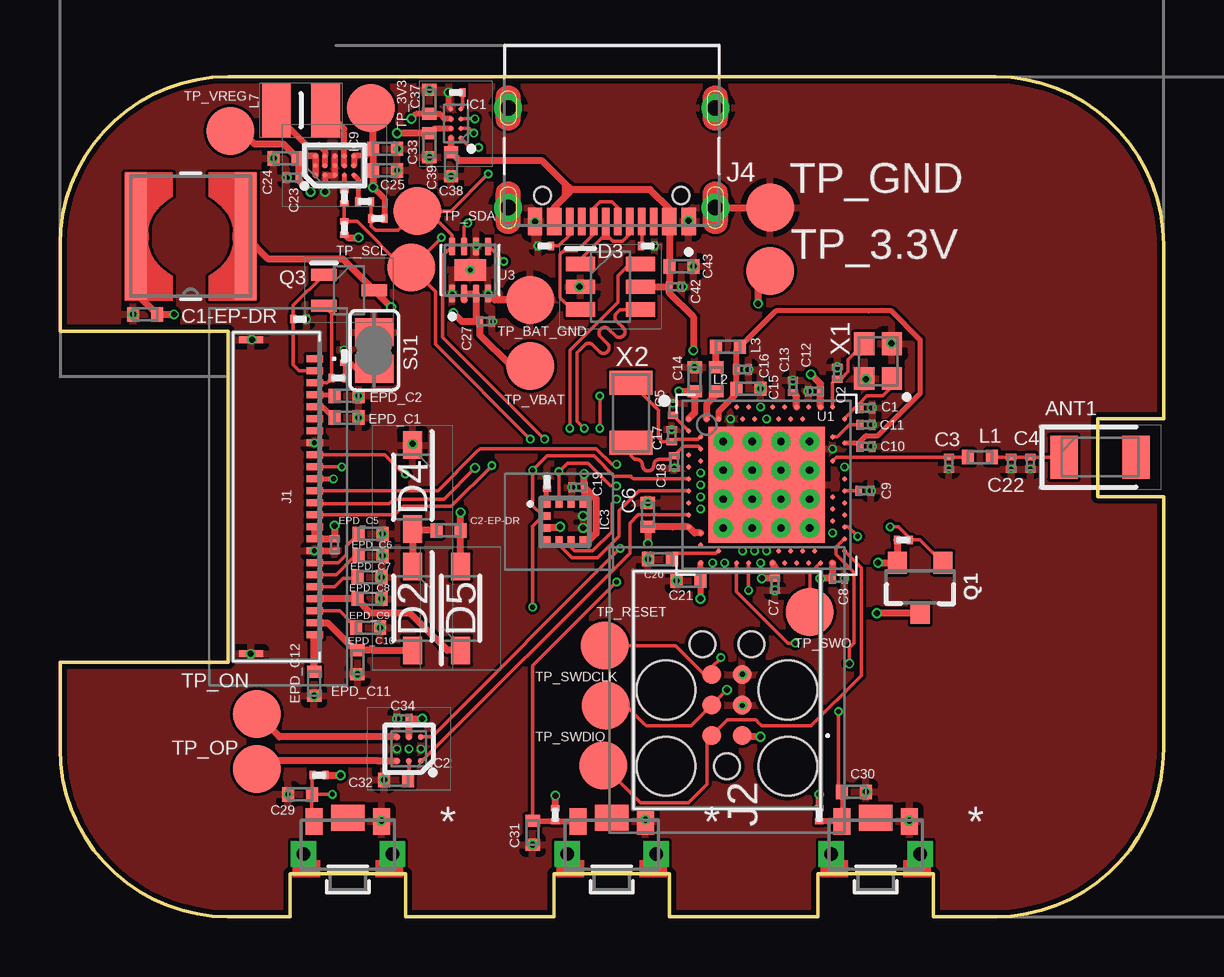
[diagram p2: board, top side]
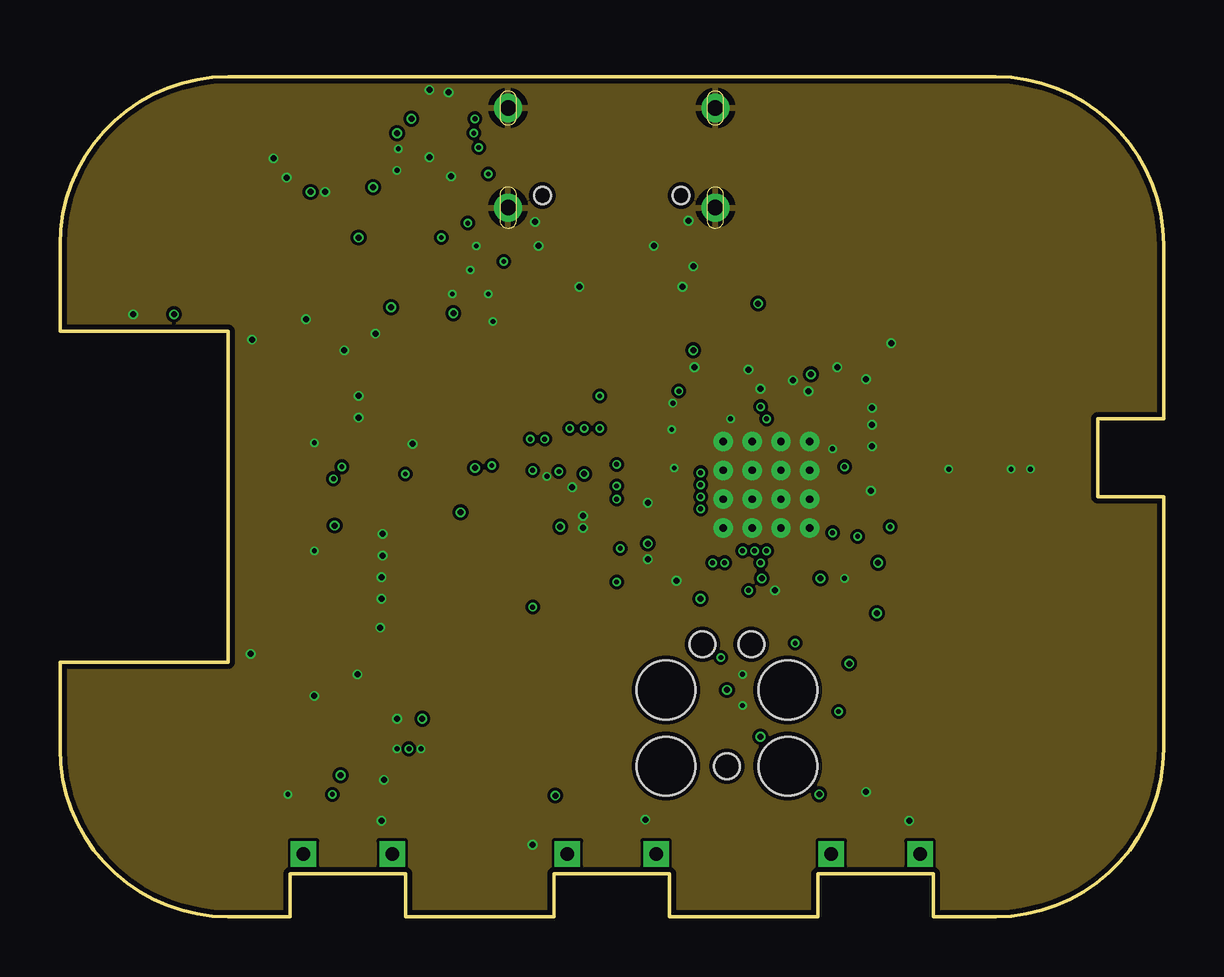
[diagram p3: board, inner layer Route2]
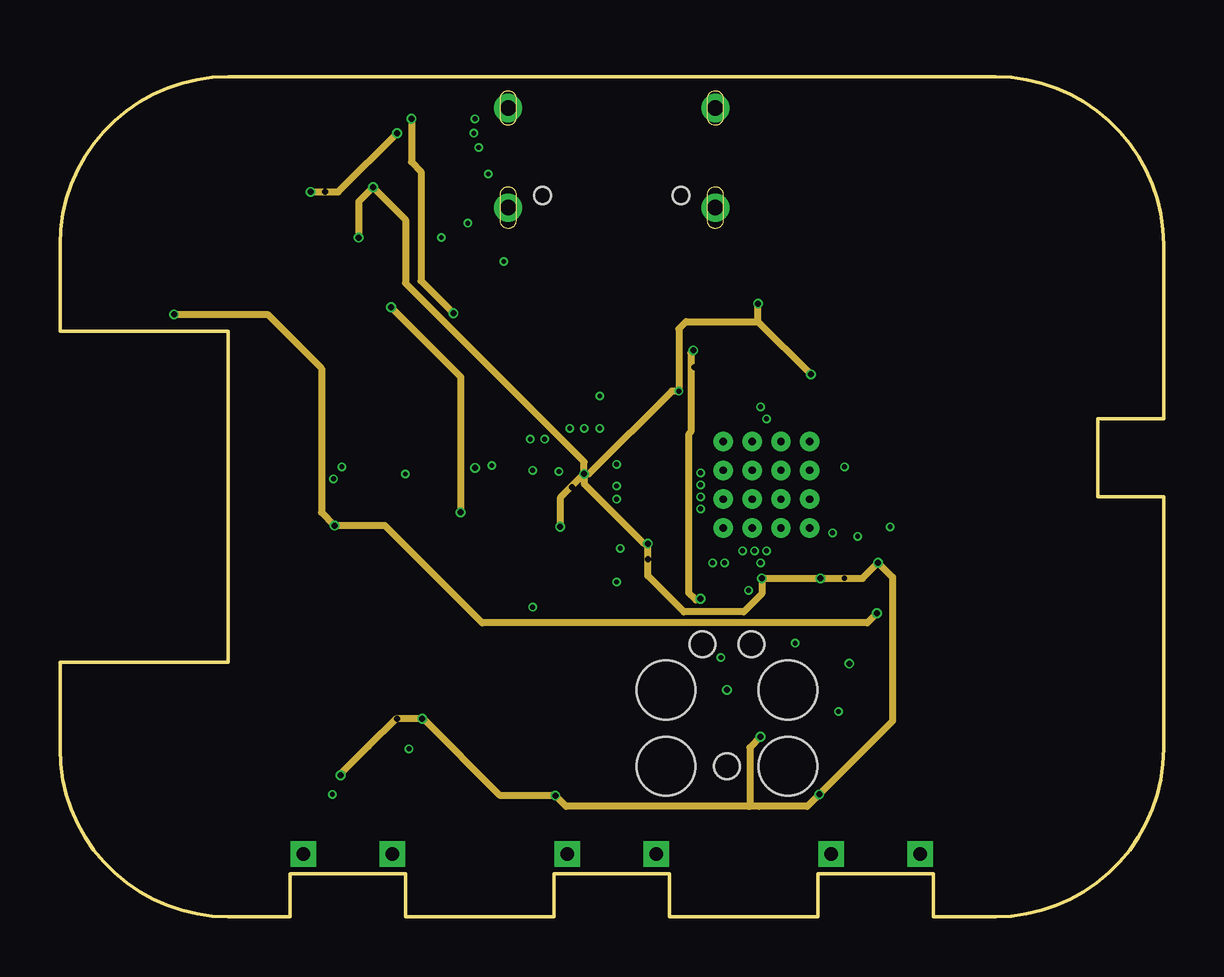
[diagram p4: board, inner layer Route15]
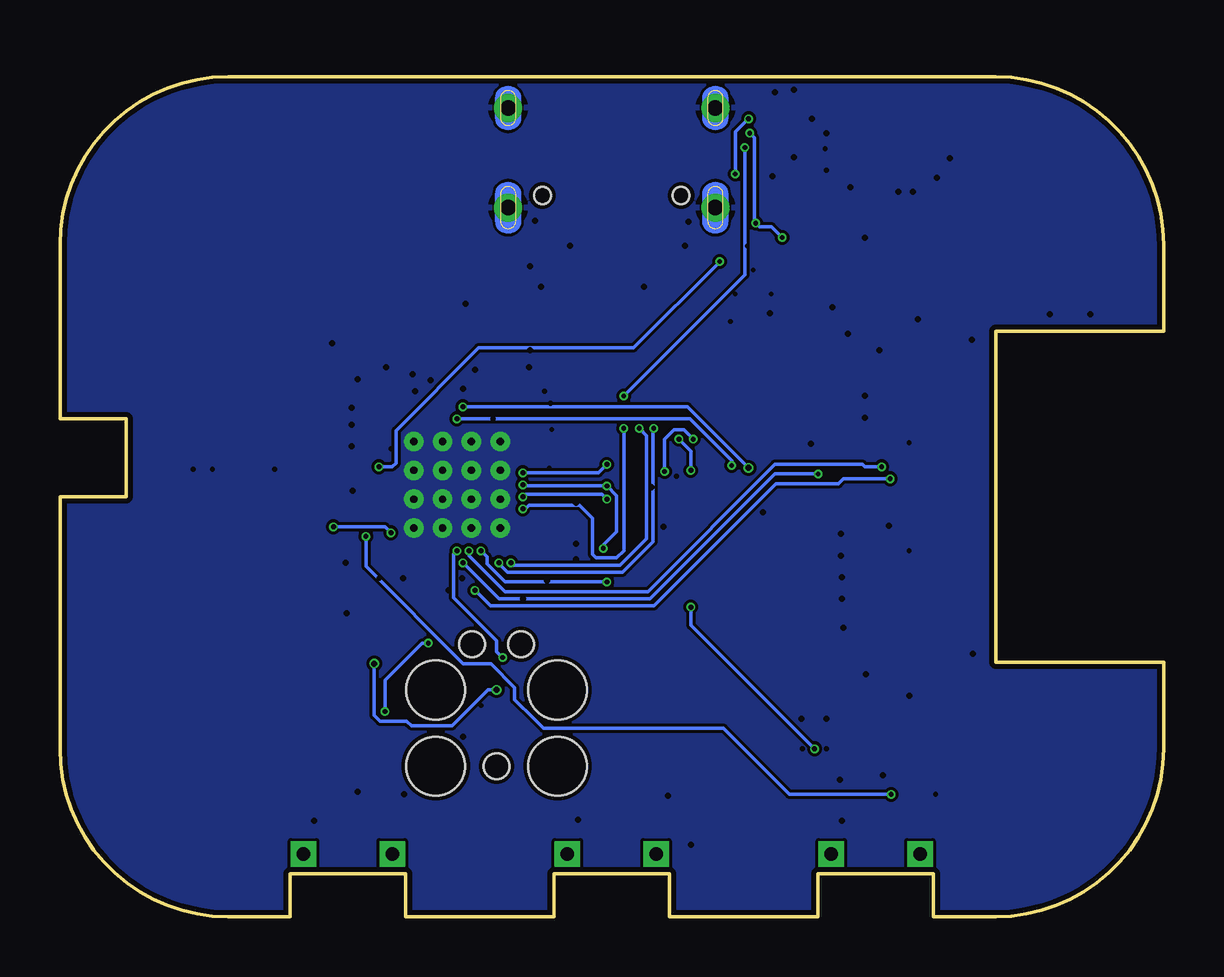
[diagram p5: board, bottom side, seen from below]

Size 46 x 35 mm. Coordinates in mm from the lower left corner, seen from the top.
Outline: 39,0 36.4,0 36.4,1.8 31.6,1.8 31.6,0 25.4,0 25.4,1.8 20.6,1.8 20.6,0 14.4,0 14.4,1.8 9.6,1.8 9.6,0 7,0 arc-90 0,7 0,10.6 7,10.6 7,24.4 0,24.4 0,28 arc-90 7,35 39,35 arc-90 46,28 46,20.75 43.25,20.75 43.25,17.5 46,17.5 46,7 arc-90 39,0
Copper layers ([2:(1+2*15)+16]): Top 0.035mm / dielectric 1.6mm / Route2 0.035mm / dielectric 0.15mm / Route15 0.035mm / dielectric 0.2mm / Bottom 0.035mm
Design rules "jlcpcb-2layers.dru *": minimum track width 5mil, minimum drill 0.3mm, track to track 5mil, track to pad 5mil, pad to pad 5mil, via to via 5mil, smd to smd 5mil, copper to edge 0.2mm, drill to drill 6mil, minimum pad ring 10mil, minimum via ring 3mil, stop-mask expansion 4mil, vias tented up to drill 0mil, thermal gap 10mil

### Footprints (pad centres in the part's own frame; a part is rotated, then mirrored left to right if it is on the bottom)
2450AT18B100E_ANTC3216X140N = smd 1.15 x 1.8: 1 -1.5,0; 2 1.5,0
NORDIC_NRF_3_RESC0201_L = smd 0.28 x 0.43: 1 -0.255,0; 2 0.255,0
NORDIC_NRF_3_RESC0402_L = smd 0.5 x 0.6: 1 -0.5,0; 2 0.5,0
ESP32_C6_LIBRARY_5_SOD3716X135N = smd 1.15 x 0.8: 1 -1.75,0; 2 1.75,0
ESP32_C6_LIBRARY_3_SOT95P280X145-6N = smd 1.2 x 0.6: 1 -1.25,0.95; 2 -1.25,0; 3 -1.25,-0.95; 4 1.25,-0.95; 5 1.25,0; 6 1.25,0.95
BQ25180YBGR_BGA8C40P2X4_100X155X50 = smd 0.2 x 0.2: A1 -0.2,0.6; A2 0.2,0.6; B1 -0.2,0.2; B2 0.2,0.2; C1 -0.2,-0.2; C2 0.2,-0.2; D1 -0.2,-0.6; D2 0.2,-0.6
DRV2605YZFR_BGA9C50P3X3_144X144X62 = smd 0.25 x 0.25: A1 -0.5,0.5; A2 0,0.5; A3 0.5,0.5; B1 -0.5,0; B2 0,0; B3 0.5,0; C1 -0.5,-0.5; C2 0,-0.5; C3 0.5,-0.5
BMA423_BMA423 = smd 0.3 x 0.35: 1 -0.75,-0.775; 2 -0.25,-0.775; 3 0.25,-0.775; 4 0.75,-0.775; 7 0.75,0.775; 8 0.25,0.775; 9 -0.25,0.775; 10 -0.75,0.775 | smd 0.35 x 0.3: 5 0.775,-0.25; 6 0.775,0.25; 11 -0.775,0.25; 12 -0.775,-0.25
RT6160AWSC_BGA15C40P3X5_140X230X60 = smd 0.216 x 0.216: A1 -0.4,0.8; A2 0,0.8; A3 0.4,0.8; B1 -0.4,0.4; B2 0,0.4; B3 0.4,0.4; C1 -0.4,0; C2 0,0; C3 0.4,0; D1 -0.4,-0.4; D2 0,-0.4; D3 0.4,-0.4; E1 -0.4,-0.8; E2 0,-0.8; E3 0.4,-0.8
503480-2400_5034802400 = smd 0.3 x 0.7: 1 -5.75,1.525; 2 -5.25,1.525; 3 -4.75,1.525; 4 -4.25,1.525; 5 -3.75,1.525; 6 -3.25,1.525; 7 -2.75,1.525; 8 -2.25,1.525; 9 -1.75,1.525; 10 -1.25,1.525; 11 -0.75,1.525; 12 -0.25,1.525; 13 0.25,1.525; 14 0.75,1.525; 15 1.25,1.525; 16 1.75,1.525; 17 2.25,1.525; 18 2.75,1.525; 19 3.25,1.525; 20 3.75,1.525; 21 4.25,1.525; 22 4.75,1.525; 23 5.25,1.525; 24 5.75,1.525 | smd 0.3 x 1: MP1 -6.54,-1.125; MP2 6.54,-1.125
TC2030-IDC_TC2030IDC = smd 0.783 x 0.783: 1 -0.953,-0.635; 2 -0.953,0.635; 3 0.317,-0.635; 4 0.317,0.635; 5 1.588,-0.635; 6 1.588,0.635 | hole 2.451: -2.223,-2.54; -2.223,2.54; 0.952,-2.54; 0.952,2.54 | hole 1.067: -2.223,0; 2.857,-1.016; 2.857,1.016
KH-TYPE-C-16P_KINGHELM_KH-TYPE-C-16P = smd 0.6 x 1.15: A1_B12 -3.2,4.725; A4_B9 -2.4,4.725; A9_B4 2.4,4.725; A12_B1 3.2,4.725 | smd 0.3 x 1.15: A5 -1.25,4.725; A6 -0.25,4.725; A7 0.25,4.725; A8 1.25,4.725; B5 1.75,4.725; B6 0.75,4.725; B7 -0.75,4.725; B8 -1.75,4.725 | drill 0.65 pad 1.05: SH1 -4.32,0; SH2 4.32,0; SH3 -4.32,4.15; SH4 4.32,4.15 | hole 0.7: -2.89,3.65; 2.89,3.65
NORDIC_NRF_2_RESC0402_L = smd 0.5 x 0.6: 1 -0.5,0; 2 0.5,0
ESP32_C6_LIBRARY_2_IND_4828-WE-TPC_WRE = smd 0.9 x 5.3: 1 -2.286,0; 2 2.286,0
MLP2016SR47MT0S1_INDC2016X100N = smd 1.2 x 2.2: 1 -1.028,0; 2 1.028,0
ESP32_C6_LIBRARY_4_ESP32_C6_LIBRARY_4_ESP32_C6_LIBRARY_4_ESP32_C6_LIBRARY_4_ESP32_WROVER_SPARKFUN-DISCRETESEMI_SOT23-3 = smd 0.8 x 0.9: 1 -0.95,-1; 2 0.95,-1; 3 0,1.1
ESP32_C6_LIBRARY_6_SOT65P210X110-3N = smd 1.05 x 0.5: 1 -1.05,0.65; 2 -1.05,-0.65; 3 1.05,0
CPF0201D7K68C1_0201 = smd 0.35 x 0.25: 1 0,0.275; 2 0,-0.275
ESP32_C6_LIBRARY_7_JUMPER_SJ = smd 1.168 x 1.6: 1 -0.762,0; 2 0.762,0
2025-10-22_07-23-44_LIBRARY_SW_EVP-AKE31A_PAN = smd 0.711 x 1.092: 1 -1.4,-0.972; 2 1.4,-0.972 | drill 0.559 pad 0.914 square: 3 -1.848,0.381; 4 1.848,0.381 | smd 1.397 x 1.092: 5 0,-1.124
HECTOR_WATCH_1_TP20R = smd 2 x 2: TP 0,0
NORDIC_NRF_4_AQFN50P700X700X85_HS-74N = smd 4.85 x 4.85: P$74 0,0 | drill 0.3 pad 0.6: P$75 -1.8,1.8; P$76 -0.6,1.8; P$77 0.6,1.8; P$78 1.8,1.8; P$79 -1.8,0.6; P$80 -0.6,0.6; P$81 0.6,0.6; P$82 1.8,0.6; P$83 -1.8,-0.6; P$84 -0.6,-0.6; P$85 0.6,-0.6; P$86 1.8,-0.6; P$87 -1.8,-1.8; P$88 -0.6,-1.8; P$89 0.6,-1.8; P$90 1.8,-1.8 | smd 0.2 x 0.2: P$A8 -1.25,3.25; P$A10 -0.75,3.25; P$A12 -0.25,3.25; P$A14 0.25,3.25; P$A16 0.75,3.25; P$A18 1.25,3.25; P$A20 1.75,3.25; P$A22 2.25,3.25; P$A23 2.75,3.25; P$AA24 3.25,-2.25; P$AB2 -2.75,-2.5; P$AC5 -2,-2.75; P$AC9 -1,-2.75; P$AC11 -0.5,-2.75; P$AC13 0,-2.75; P$AC15 0.5,-2.75; P$AC17 1,-2.75; P$AC19 1.5,-2.75; P$AC21 2,-2.75; P$AC24 3.25,-2.75; P$AD2 -2.75,-3.25; P$AD4 -2.25,-3.25; P$AD6 -1.75,-3.25; P$AD8 -1.25,-3.25; P$AD10 -0.75,-3.25; P$AD12 -0.25,-3.25; P$AD14 0.25,-3.25; P$AD16 0.75,-3.25; P$AD18 1.25,-3.25; P$AD20 1.75,-3.25; P$AD22 2.25,-3.25; P$AD23 2.75,-3.25; P$B1 -3.25,2.75; P$B3 -2.5,2.75; P$B5 -2,2.75; P$B7 -1.5,2.75; P$B9 -1,2.75; P$B11 -0.5,2.75; P$B13 0,2.75; P$B15 0.5,2.75; P$B17 1,2.75; P$B19 1.5,2.75; P$B24 3.25,2.75; P$C1 -3.25,2.25; P$D2 -2.75,2; P$D23 2.75,2; P$E24 3.25,1.75; P$F2 -2.75,1.5; P$F23 2.75,1.5; P$G1 -3.25,1.25; P$H2 -2.75,1; P$H23 2.75,1; P$J1 -3.25,0.75; P$J24 3.25,0.75; P$K2 -2.75,0.5; P$L1 -3.25,0.25; P$L24 3.25,0.25; P$M2 -2.75,0; P$N1 -3.25,-0.25; P$N24 3.25,-0.25; P$P2 -2.75,-0.5; P$P23 2.75,-0.5; P$R1 -3.25,-0.75; P$R24 3.25,-0.75; P$T2 -2.75,-1; P$T23 2.75,-1; P$U1 -3.25,-1.25; P$U24 3.25,-1.25; P$V23 2.75,-1.5; P$W1 -3.25,-1.75; P$W24 3.25,-1.75; P$Y2 -2.75,-2; P$Y23 2.75,-2
ESP32_C6_LIBRARY_SON50P200X200X80-9N = smd 0.76 x 0.27: 1 -0.985,0.75; 2 -0.985,0.25; 3 -0.985,-0.25; 4 -0.985,-0.75; 5 0.985,-0.75; 6 0.985,-0.25; 7 0.985,0.25; 8 0.985,0.75 | smd 0.9 x 1.3: 9 0,0
NORDIC_NRF_BT-XTAL_2016_N = smd 0.95 x 0.85: 1 -0.725,-0.575; 2 0.725,-0.575; 3 0.725,0.575; 4 -0.725,0.575
NORDIC_NRF_1_XTAL_3215_N = smd 1 x 1.8: 1 -1.25,0; 2 1.25,0

### Placement (x,y rotation side)
ANT1  43.35,19.15 0 top
C1  33.6,21.2 0 top
C1-EP-DR  3.55,25.1 180 top
C2  32.4,22.65 90 top
C2-EP-DR  16.2,16.1 0 top
C3  37.05,18.9 270 top
C4  40.45,18.9 270 top
C5  25.55,21.15 90 top
C6  24.5,16.75 90 top
C7  29.8,13.85 270 top
C8  32.45,14.1 0 top
C9  33.55,17.75 0 top
C10  33.6,19.6 0 top
C11  33.6,20.5 0 top
C12  31.45,21.9 180 top
C13  30.55,22.1 90 top
C14  26.45,22.4 90 top
C15  28.7,22 0 top
C16  28.45,22.8 0 top
C17  25.5,20.05 270 top
C18  25.6,18.95 90 top
C19  21.6,17.9 180 top
C20  25,14.9 180 top
C21  26.2,14 180 top
C22  39.65,18.9 270 top
C23  9.7,30.8 0 top
C24  9.4,31.6 0 top
C25  13.55,31.1 0 top
C27  17.75,24.8 0 top
C29  10,5.1 180 top
C30  33.1,5.2 0 top
C31  19.7,3.5 270 top
C32  14,5.7 180 top
C33  13.55,32 0 top
C34  14.3,8.25 180 top
C37  15.4,33.95 90 top
C38  16.3,31.35 270 top
C39  15.4,32.15 270 top
C42  25.65,26.25 0 top
C43  25.9,27.1 0 top
D2  14.7,12.85 270 top
D3  22.95,26.25 0 top
D4  14.7,17.9 270 top
D5  16.7,12.85 90 top
EPD_C1  11.95,20.8 180 top
EPD_C2  11.95,21.7 180 top
EPD_C5  11.45,15.5 90 top
EPD_C6  12.95,15.95 180 top
EPD_C7  12.95,15.05 180 top
EPD_C8  12.9,14.15 180 top
EPD_C9  12.9,13.25 180 top
EPD_C10  12.85,12.05 180 top
EPD_C11  12.4,10.6 90 top
EPD_C12  10.6,9.7 90 top
IC1  16.5,33.05 180 top
IC2  14.55,7 180 top
IC3  21.05,16.45 270 top
IC9  11.45,31.3 90 top
J1  9.1,17.5 270 top
J2  27.8,8.5 90 top
J4  23,33.7 180 top
L1  38.35,19.15 0 top
L2  27.35,22.4 90 top
L3  27.85,23.75 0 top
L5  5.45,28.35 180 top
L7  10.05,33.6 0 top
Q1  35.85,13.75 180 top
Q3  12.05,26.1 0 top
R1_EP_DR  11.6,22.45 270 top
R1_USB  24.5,27.95 270 top
R2  12.7,29.8 90 top
R2_EP_DR  10,24.9 270 top
R2_USB  20.2,27.95 270 top
R3  20.3,18.1 180 top
R4  11.85,30 0 top
R5  31.65,4.25 180 top
R7  10.8,5.9 90 top
R8  20.65,4.25 180 top
R9  16.5,34.35 90 top
R17  11.85,28.7 180 top
R18  13.25,29.1 270 top
R_PWR_EPD  35.15,15.7 270 top
R_TYPE_SEL  11.85,23.35 0 top
SJ1  13.1,23.6 270 top
SW_DN  12,3 180 top
SW_ENT  23,3 180 top
SW_UP  34,3 180 top
TP_3.3V  29.6,26.9 0 top
TP_3V3  12.95,33.7 0 top
TP_BAT_GND  19.6,25.7 0 top
TP_GND  29.6,29.55 0 top
TP_ON  8.2,8.45 0 top
TP_OP  8.2,6.15 0 top
TP_RESET  22.7,11.3 0 top
TP_SCL  14.65,27.05 0 top
TP_SDA  14.9,29.4 0 top
TP_SWDCLK  22.75,8.8 0 top
TP_SWDIO  22.65,6.3 0 top
TP_SWO  31.25,12.7 0 top
TP_VBAT  19.6,22.95 0 top
TP_VREG  7.1,32.75 0 top
U1  29.45,18 0 top
U3  17.1,26.95 90 top
X1  34.1,23.15 90 top
X2  23.8,21 270 top

### Tracks (layer width: path | path; a pad name or v marks a point on that pad's centre or on a via)
3V3  (via drill 0.2 layers 1-15, 0.25 layers 1-15)
  Top 0.254: IC9.E2 IC9.E3 12.75,31.7 C33.1 | v13.05,30.4 13.53,29.93 R18.1 | R17.1 11.88,28.43
  Top 0.3: TP_3V3.TP 13.05,33.6 C33.1 C25.1 v13.05,30.4 | U1.P$B1 26.45,21 C14.1 v25.8,21.9 | U1.P$A22 C12.1 31.7,22.2 v31.3,22.6 | U1.P$AD14 29.7,14.7 29.8,14.6 C7.1 v29.25,14.1 | U1.P$AD23 | U1.P$Y2 26.45,16 U1.P$W1 25.55,16.25 C6.1 v24.5,15.55 | C19.1 21.86,17.23 IC3.10 | C19.1 22.35,17.41 22.35,17.1 22.35,15.97 22.07,15.7 IC3.7 | v29.2,7.5 28.48,7.5 J2.1 | v29.25,14.1 | v31.7,14.1 C8.1 U1.P$AD23 | R_PWR_EPD.2 34.9,15.68 Q1.2 v34.1,14.75 | IC2.C2 C34.1 v15.1,8.25 | R5.2 v31.65,5.1 | R8.2 v20.65,5.05 | v12.45,28.3 12,28.3 11.88,28.43 | R7.2 v11.7,5.9 | C19.1 v21.85,18.45 | v20.85,16.25 20.8,16.2 IC3.3 | TP_3.3V.TP 29.1,26.4 v29.1,25.55
  Route15 0.3: 28.75,4.6 29.15,4.6 31.15,4.6 v31.65,5.1 34.7,8.15 34.7,14.15 v34.1,14.75 33.45,14.1 v31.7,14.1 v29.25,14.1 29.25,13.45 28.5,12.7 26,12.7 24.5,14.2 v24.5,15.55 24.35,15.55 21.85,18.05 v21.85,18.45 | 28.75,4.6 28.7,4.6 21.1,4.6 v20.65,5.05 18.35,5.05 15.15,8.25 v15.1,8.25 14,8.25 12.85,7.1 11.7,5.95 v11.7,5.9 | v29.2,7.5 28.75,7.05 28.75,4.6 | v21.85,18.45 21.85,18.95 14.4,26.4 14.4,29.05 v13.05,30.4 12.45,29.8 v12.45,28.3 | v21.85,18.45 22.05,18.45 25.5,21.9 v25.8,21.9 25.8,24.5 26.1,24.8 29.1,24.8 | v31.3,22.6 29.1,24.8 | v21.85,18.45 20.85,17.45 v20.85,16.25 | 29.1,24.8 v29.1,25.55
ALERT  (via drill 0.2)
  Top 0.15: v18.5,27.3 17.87,27.94 U3.5
  Bottom 0.15: U1.P$J24 32.15,18.75 32,18.9 32,20.25 28.55,23.7 22.1,23.7 v18.5,27.3
  other vias: 32.7,18.75
D_N  (via drill 0.2)
  Top 0.15: D3.4 23.35,25.3 23.2,25.15 arc90 23.2,24.82 23.48,24.54 arc-90 23.48,24.21 arc-90 23.15,24.21 22.87,24.49 arc90 22.54,24.49 arc90 22.54,24.16 22.82,23.88 arc-90 22.82,23.55 arc-90 22.49,23.55 22.21,23.83 arc90 21.88,23.83 21.55,23.5 21.55,20.65 v21.85,20.35
  Bottom 0.15: 27.15,14.75 U1.P$AD4 27.1,14.65 22.65,14.65 21.55,15.75 21.55,20.05 v21.85,20.35
  other vias: 27.2,14.75
D_P  (via drill 0.2)
  Top 0.15: D3.6 24.15,27.2 24.1,27.25 23.8,27.25 23.25,26.7 23.25,25.6 21.25,23.6 v21.25,20.35
  Bottom 0.15: U1.P$AD6 27.7,14.7 27.35,14.35 22.56,14.35 22.3,14.6 21.27,15.63 21.27,20.07 21.27,20.33 v21.25,20.35
  other vias: 27.7,14.75
DEC1
  Top 0.15: U1.P$C1 C5.1
DEC3
  Top 0.15: U1.P$D23 32.4,20 32.9,20.5 C11.1
DEC4_6
  Top 0.2: U1.P$E24 33.2,19.75 C10.1 33.34,19.8 33.6,20.05 34.1,20.05 35.85,21.8 35.85,24.05 34.65,25.25 33.7,25.25 29.85,25.25 L3.2
  Top 0.254: L3.2 28.2,23.59 C16.1 C15.1 28.2,21.8 27.45,21.05 U1.P$B5
DN
  Top 0.15: 22.75,28.45 22.93,28.27 | 22.93,28.27 23.05,28.15 23.45,28.15 23.75,28.45 J4.B7 | J4.A7 22.75,28.45 | 22.75,28.45 22.68,28.38 22.55,28.25 | 22.55,28.25 22,27.7 21.7,27.4 D3.1 | 22.55,28.25 22.57,28.27 22.93,28.27
DP
  Top 0.15: 22.2,25.3 D3.3 21.35,25.3 20.85,25.8 20.85,27.6 21,27.75 21.55,27.75 21.7,27.9 22.25,28.45 J4.B6 22.25,29.55 22.5,29.8 22.75,29.8 23,29.8 23.25,29.55 J4.A6
EPD_3V3  (via drill 0.25 layers 1-15)
  Top 0.3: J1.15 J1.16 EPD_C5.2 v11.45,16.3 | C1-EP-DR.1 v4.75,25.1 | Q1.3 v34.05,12.65 | C1-EP-DR.1 4,25.1 | C1-EP-DR.1 3.16,25.99 L5.2
  Route15 0.3: v4.75,25.1 8.65,25.1 10.9,22.85 10.9,16.85 v11.45,16.3 13.55,16.3 17.6,12.25 33.65,12.25 v34.05,12.65
EPD_BUSY  (via drill 0.2)
  Top 0.15: v14.4,18.45 14.32,18.45 13.53,19.25 J1.9
  Bottom 0.15: v14.4,18.45 16.2,18.45 21.4,13.25 27.7,13.25 U1.P$AD12
  other vias: 29.2,14.75
EPD_CS  (via drill 0.2)
  Top 0.15: J1.12 15.75,17.75 17.35,19.35 17.5,19.5 22.35,19.5 23,18.85 v23.2,18.85
  Bottom 0.15: U1.P$K2 23.55,18.5 v23.2,18.85
  other vias: 26.7,18.5
EPD_DC  (via drill 0.2)
  Top 0.15: U1.P$AD10 v28.7,13.6
  Top 0.2: J1.11 v11.4,18.25
  Bottom 0.15: v11.4,18.25 13.35,18.25 13.55,18.05 16.15,18.05 21.25,12.95 28.05,12.95 v28.7,13.6
EPD_RST  (via drill 0.2)
  Top 0.15: J1.10 v11.75,18.75
  Bottom 0.15: v11.75,18.75 12.45,18.75 12.55,18.85 16.2,18.85 21.5,13.55 27.45,13.55 28.95,15.05 U1.P$AC11
  other vias: 28.95,15.25
GDR
  Top 0.15: J1.2 9.97,22.75 9.72,23 R2_EP_DR.2 9.72,25.48 Q3.1
GND  (via drill 0.2 layers 1-2, 0.25 layers 1-2)
  Top 0.15: D3.2 v21.65,26.25
  Top 0.2: IC1.D2 16.23,33.73 R9.1 | v25.6,18.7 25.64,18.7 v25.6,18.7 | X1.2 v34.65,23.9 | v10.25,24.9 R2_EP_DR.1 | C34.2 v14.05,8.25 | C2.2 v32.4,22.9 | C10.2 v33.85,19.6 | J4.A12_B1 v19.8,28.95 | v33.8,17.75 | C19.2 | C5.2 | C13.2 | C16.2 v28.7,22.8 | R1_USB.1 v24.75,27.95 | C1.2 v33.85,21.2 | C11.2 v33.85,20.5 | R3.2 v20.3,18.35 | C3.2 | C22.2 | C4.2
  Top 0.254: IC9.C2 11.45,31.25 | v10.6,19.75 J1.8 | v10.6,15.25 J1.17 EPD_C5.1 | IC9.C2 IC9.C1 IC9.B1 v11.05,30.2 | IC9.C3 IC9.C2
  Top 0.3: TP_BAT_GND.TP 18.12,25.7 U3.4 17.88,25.96 17.87,25.95 v17.85,25.95 | v35.4,4 | v35.4,4 SW_UP.1 | SW_ENT.1 | SW_ENT.1 v24.4,4.05 | v9.45,30.8 | R2_USB.2 v19.95,27.95 | C33.2 v14.1,32 | SW_DN.1 | SW_DN.1 v13.4,4 | J1.MP1 7.98,24.05 v8,24.05 | D4.1 v14.7,19.7 | v25.95,26.25 C42.2 | X1.4 33.58,22.43 v33.6,22.4 | J1.MP2 v7.95,10.95 | IC3.8 v21.8,16.2 | IC3.9 v21.8,16.7 | v28.45,10.1 J2.5 | v28.45,8.8 J2.3 | C27.2 v18.05,24.8 | v16.35,25.95 U3.1 | v17.35,27.95 17.34,27.94 U3.6 | R_TYPE_SEL.1 v11.85,23.6 | C8.2 v32.7,14.1 | J4.A1_B12 v26.2,29 | C7.2 | v16.2,34.35 R9.1 | C17.1 | v31.2,21.9 | v13.15,24.3 13.15,24.31 SJ1.1 | U1.P$74 U1.P$81 | J4.SH3 TP_GND.TP
  other vias: 26.4,27.1 12.45,21.7 12.45,20.8 13.45,15.95 13.45,15.05 13.4,14.15 13.4,13.25 13.35,12.05 12.4,10.1 10.6,9.2 25.55,21.4 25.5,20.3 30.55,22.35 3.05,25.1 19.7,3 13.5,5.7 33.6,5.2 21.35,17.9 24.5,17.25 24.5,14.9 25.7,14 29.2,22 26.45,22.9 16.3,30.85 15.4,31.65 15.4,34.45 8.9,31.6 14.05,7 15.05,7 9.5,5.1 17.1,26.95 14.05,31.1 29.8,13.6 32.2,19.5 27.95,20.75 40.45,18.65 39.65,18.65 37.05,18.65
  pour Route2: -4.32,-4.12 52.02,-4.12 52.02,42.12 -4.32,42.12
  pour Top: -1.25,-2.2 47.05,-2.2 47.05,40 -1.25,40
  pour Bottom: -1.87,-2.77 49.42,-2.77 49.42,40.12 -1.87,40.12
HAPTIC_EN
  Top 0.15: U1.P$U1 24.1,16.75 23.75,16.4 23.75,15.15 15.1,6.5 IC2.A1
IMU_INT1
  Top 0.15: U1.P$N1 26.15,17.75 24.12,17.75 23.3,16.93 23.3,15.85 22.4,14.95 21.35,14.95 20.8,15.5 IC3.5
IMU_INT2  (via drill 0.2)
  Top 0.15: v23.2,17.4 23,17.2 23,16.05 22.2,15.25 21.45,15.25 21.3,15.4 IC3.6
  Bottom 0.15: U1.P$P2 26.6,17.6 23.4,17.6 v23.2,17.4
  other vias: 26.7,17.5
LX1
  Top 0.254: IC9.B2 IC9.B3 11.05,31.9 10.8,32.15 10.27,32.15 9.02,33.4 L7.1
LX2
  Top 0.254: IC9.D2 IC9.D3 11.85,32.83 L7.2
MOSI  (via drill 0.2 pad 0.1)
  Top 0.15: J1.14 13.1,16.75 13.95,16.75 14.3,17.1 16.3,17.1 v18,18.8
  Bottom 0.15: U1.P$B13 19.75,20.75 18,19 v18,18.8
  other vias: 29.45,20.75
N$1
  Top 0.15: 11.4,21.75 EPD_C2.2
  Top 0.2: J1.4 11.4,21.75 EPD_C2.2
N$2
  Top 0.3: C2-EP-DR.1 14.75,16.1 D4.2 D2.1
N$3
  Top 0.15: R9.2 16.77,33.73 IC1.D1
N$4
  Top 0.15: L1.2 C22.1 C4.1 ANT1.1
N$5
  Top 0.15: U1.P$A23 32.2,22.25 32.35,22.39 C2.1 32.55,22.39 32.85,22.7 32.85,23 32.85,23.2 X1.3
N$6
  Top 0.15: U1.P$B24 32.8,20.84 32.8,20.85 33.14,21.2 C1.1 33.34,21.4 33.64,21.7 34.3,21.7 34.67,22.07 X1.1
N$7  (via drill 0.25 layers 1-15)
  Top 0.3: L5.1 8.69,27.4 11.8,27.4 Q3.3 v13.8,25.4 | v16.7,16.85 C2-EP-DR.2 D5.2
  Route15 0.3: v16.7,16.85 16.7,16.9 16.7,22.5 v13.8,25.4
N$8
  Top 0.2: IC9.E1 12.43,30.73 R2.1
N$9
  Top 0.15: 11.4,20.8 EPD_C1.2
  Top 0.2: J1.5 10.95,21.25 11.4,20.8
N$10
  Top 0.2: IC9.D1 R4.1
N$11
  Top 0.2: R1_EP_DR.1 11.88,23.05 R_TYPE_SEL.2 12.1,23.07 12.34,22.84 SJ1.2
N$12
  Top 0.3: U1.P$A18 30.7,21.7 C13.1
N$13
  Top 0.15: J1.18 11.6,14.75 11.95,15.1 11.95,15.2 11.95,15.45 EPD_C6.2
N$14
  Top 0.2: IC3.1 20.27,17.8 R3.1
N$15
  Top 0.15: C20.1 25.75,15.15 27.35,15.15 U1.P$AC5
N$16
  Top 0.15: EPD_C7.2 12.3,15.05 11.5,14.25 J1.19
N$17
  Top 0.15: EPD_C8.2 12.35,14.1 11.85,14.1 11.8,14.1 11.45,13.75 J1.20
N$19
  Top 0.3: U1.P$B3 26.95,20.9 26.95,21.35 27.35,21.75 L2.1
N$20
  Top 0.3: L2.2 L3.1
N$21
  Top 0.15: EPD_C10.2 11.65,12.75 J1.22
N$22
  Top 0.15: C9.1 U1.P$N24
N$23
  Top 0.15: C32.1 14.55,5.75 IC2.A2
N$25
  Top 0.15: U1.P$H23 32.36,19.16 34.65,19.16 C3.1 L1.1
N$26
  Top 0.3: EPD_C12.2 10.6,11.72 J1.24
N$28
  Top 0.15: R2_USB.1 20.77,27.95 21.25,28.43 J4.B5
N$33
  Top 0.15: J4.A5 24.25,27.98 R1_USB.2
OUT+
  Top 0.3: TP_OP.TP 8.55,6.5 13.25,6.5 IC2.A3
OUT-
  Top 0.3: IC2.C3 9.15,7.5 TP_ON.TP
P0.00
  Top 0.15: U1.P$D2 26.6,19.9 25.61,19.9 C17.2 25.11,19.8 25,19.9 24.95,19.95 24.95,21.1 X2.1
P0.01
  Top 0.15: U1.P$F2 26.61,19.59 25.99,19.59 C18.2 25.45,19.05 24.98,19.05 arc90 24.75,18.82 24.75,18.81 arc-90 24.52,18.57 arc-90 24.28,18.81 24.28,18.82 arc90 24.05,19.05 23.95,19.05 23.8,19.2 X2.2
P0.13  (via drill 0.2)
  Top 0.15: U1.P$AD8 28.2,13.55 30.35,11.4 v30.65,11.4 | SW_UP.2 C30.1 32.45,5.35 v32.45,8.55 | SW_UP.2
  Top 0.254: SW_UP.2 R5.1
  Bottom 0.15: v30.65,11.4 30.9,11.4 32.45,9.85 v32.45,8.55
P0.14  (via drill 0.2)
  Top 0.15: C31.1 19.7,10.45 v23.2,13.95
  Top 0.254: R8.1 SW_ENT.2 | SW_ENT.2 | C31.1 SW_ENT.2
  Bottom 0.15: U1.P$AC9 28.2,15 28.2,14.7 27.45,13.95 v23.2,13.95
  other vias: 28.45,15.25
P1.01  (via drill 0.2)
  Top 0.15: v34.6,16.25 34.95,16.25 35.42,15.78 R_PWR_EPD.1 35.85,15.7 Q1.1
  Bottom 0.15: v34.6,16.25 32.45,16.25 U1.P$Y23
  other vias: 32.2,16
P1.02  (via drill 0.2)
  Top 0.15: v33.25,15.85 32.85,16.25 U1.P$W24 | C29.1 10.5,5.9 R7.1 | C29.1 v11.35,5.1 | C29.1 | C29.1 10.5,4.07 SW_DN.2
  Bottom 0.15: v33.25,15.85 33.25,14.6 29.19,10.54 28.24,10.54 28.04,10.54 27.05,9.55 27.05,9.05 26.25,8.25 25.85,7.85 25.55,7.85 18.35,7.85 15.6,5.1 v11.35,5.1
PMIC_INT  (via drill 0.2)
  Top 0.15: v17.45,32.05 17.1,32.05 IC1.A1 | v22.5,21.7 v22.5,20.35
  Bottom 0.15: U1.P$T2 26.6,17 26.45,17.15 25.35,17.15 24.35,17.15 23.9,16.7 23.8,16.6 23.8,15.1 23.65,14.95 22.8,14.95 22.5,15.25 v22.5,20.35 | v17.45,32.05 17.45,29.3 17.45,26.75 v22.5,21.7
  other vias: 26.7,17
PREVGH
  Top 0.3: J1.21 EPD_C9.2 12.4,13.2 12.95,12.65 14.6,12.65 15.1,12.15 16.15,11.1 D5.1
PREVGL
  Top 0.3: J1.23 11.15,12.25 12.3,11.1 EPD_C11.2 13.05,11.1 D2.2
RESE
  Top 0.15: J1.3 11.12,22.25 R1_EP_DR.2 11.32,25.12 Q3.2
RESET  (via drill 0.2)
  Top 0.15: v27.55,10.8 27.55,10.77 27.16,10.39 J2.6 26.87,10.09 25.65,11.3 TP_RESET.TP
  Bottom 0.15: v27.55,10.8 27.8,11.05 27.8,11.5 29.6,13.3 29.6,15.1 U1.P$AC13
  other vias: 29.45,15.25
SCK  (via drill 0.2, 0.25)
  Top 0.15: v17.3,18.7 16,17.4 13.93,17.4 13.72,17.2 10.68,17.2 J1.13
  Bottom 0.15: U1.P$A12 19.85,21.25 v17.3,18.7
  other vias: 29.2,21.25
SCL  (via drill 0.2)
  Top 0.15: IC3.12 v20.8,18.55 21.15,18.9 22,18.9 22.8,18.1 22.95,17.95 v23.2,17.95 | v23.35,15.35 15.5,7.5 IC2.C1 | v17,28.9 16.85,28.75 U3.7 | v17.25,32.65 17.05,32.85 IC1.B1 | R4.2 R17.2 12.35,28.98 12.38,28.98 14.3,27.05 TP_SCL.TP | v15.9,28.3 TP_SCL.TP | TP_SCL.TP 15.65,26.05 15.65,23.85 v19.6,19.9
  Bottom 0.15: v23.35,15.35 23.35,15.5 22.8,16.05 22.8,17.55 v23.2,17.95 26.65,17.95 U1.P$M2 | v17.25,32.65 17.05,32.45 17.05,28.95 v17,28.9 16.85,28.75 16.35,28.75 16.1,28.5 v15.9,28.3 | v19.6,19.9 20,20.3 20.4,20.3 20.8,19.9 v20.8,18.55
  other vias: 26.7,18
SDA  (via drill 0.2)
  Top 0.15: IC3.2 20.12,16.7 | 20.12,16.7 19.7,17.12 v19.7,18.6 20.3,19.2 22.25,19.2 23.1,18.35 23.8,18.35 23.85,18.3 23.9,18.25 U1.P$L1 | TP_SDA.TP 15.35,29.4 16.35,28.4 U3.8 15.95,27.54 15.95,24.15 v20.2,19.9 | TP_SDA.TP 16.3,29.4 v17.85,30.95 | IC1.C1 16.85,33.25 v17.3,33.25 | TP_SDA.TP 14.1,28.6 13.15,28.6 12.97,28.77 R18.2 R2.2 | v19.7,12.9 19.7,16.27 20.12,16.7
  Bottom 0.15: v19.7,12.9 19.7,12.15 IC2.B2 | v17.85,30.95 17.85,32.7 v17.3,33.25 | v19.7,18.6 19.7,19.4 v20.2,19.9
  other vias: 14.55,7
SWDCLK  (via drill 0.25)
  Top 0.15: U1.P$AA24 32.35,15.4 32.35,15.1 32.8,14.65 33.1,14.35 33.1,11.4 32.9,11.2 v32.9,10.55 | TP_SWDCLK.TP 23.6,8.8 24.35,8.05 24.45,7.95 26.25,7.95 26.3,7.95 J2.4 v27.8,9.45
  Bottom 0.15: v27.8,9.45 28.15,9.45 29.65,7.95 31.35,7.95 31.55,8.15 32.4,8.15 32.65,8.15 32.9,8.4 v32.9,10.55
SWDIO
  Top 0.15: U1.P$AC24 33.4,14.55 33.4,13.6 33.4,10.05 31.3,7.95 29.25,7.95 29.1,8.1 29,8.2 27.82,8.2 J2.2 | 27.07,7.65 J2.2 | TP_SWDIO.TP 24.2,4.75 26.2,4.75 26.96,5.52 26.96,7.35 J2.2
SWO
  Top 0.15: U1.P$AD22 31.25,14.3 TP_SWO.TP
VBAT  (via drill 0.25 layers 1-15)
  Top 0.254: IC1.C2 16.04,33.25 15.84,33.45 C37.1 15.15,33.45 14.85,33.45 v14.65,33.25
  Top 0.3: 16.85,25.7 U3.2 U3.3 17.35,24.95 C27.1 | C27.1 16.75,24.8 v16.4,25.15 | C27.1 17.5,24.25 18.8,22.95 TP_VBAT.TP
  Route15 0.3: v14.65,33.25 14.65,31.45 15.05,31.05 15.05,26.5 v16.4,25.15
VBUS  (via drill 0.25 layers 1-15)
  Top 0.254: C42.1 | D3.5 24.8,26.25 | U1.P$AD2 C21.1 v26.7,13.25
  Top 0.28: C38.1 IC1.A2
  Top 0.3: C42.1 C43.1 J4.A4_B9 25.4,29.5 24.6,30.3 21.25,30.3 | 24.8,26.25 C42.1 25.39,26 26.4,25 v26.4,23.6 | J4.A9_B4 20.6,29.55 21.05,30 | 21.05,30 21.05,30.05 21.05,30.55 | 21.05,30.55 20.1,31.5 16.65,31.5 C38.1 | 21.05,30 21.25,30.2 21.25,30.3 | 21.05,30.55 21.25,30.35 21.25,30.3
  Route15 0.3: v26.4,23.6 26.3,23.5 26.3,20.2 26.2,20.1 26.2,13.5 26.5,13.2 26.65,13.2 v26.7,13.25
VREG  (via drill 0.25 layers 1-15)
  Top 0.254: C39.1 15.6,32.85 IC1.B2 | TP_VREG.TP 7.55,32.75 | 10,31.7 C24.2 9.96,31.55
  Top 0.28: IC9.A1 IC9.A2 IC9.A3 10,31.7
  Top 0.3: C39.1 v14.05,32.65 | v10.45,30.2 9.96,30.7 C23.2 9.96,31.55 | 7.55,32.75 8.1,32.2 9.3,32.2 C24.2
  Route15 0.3: v10.45,30.2 11.6,30.2 v14.05,32.65
(copper drawn outside any net)
  shapes: Bottom area x1, Route2 area x1, Top area x1